# EasyEDA Pro project ProProject_blueberry_2023-11-09.epro, schematic blueberry

## Sheets
1 POWER
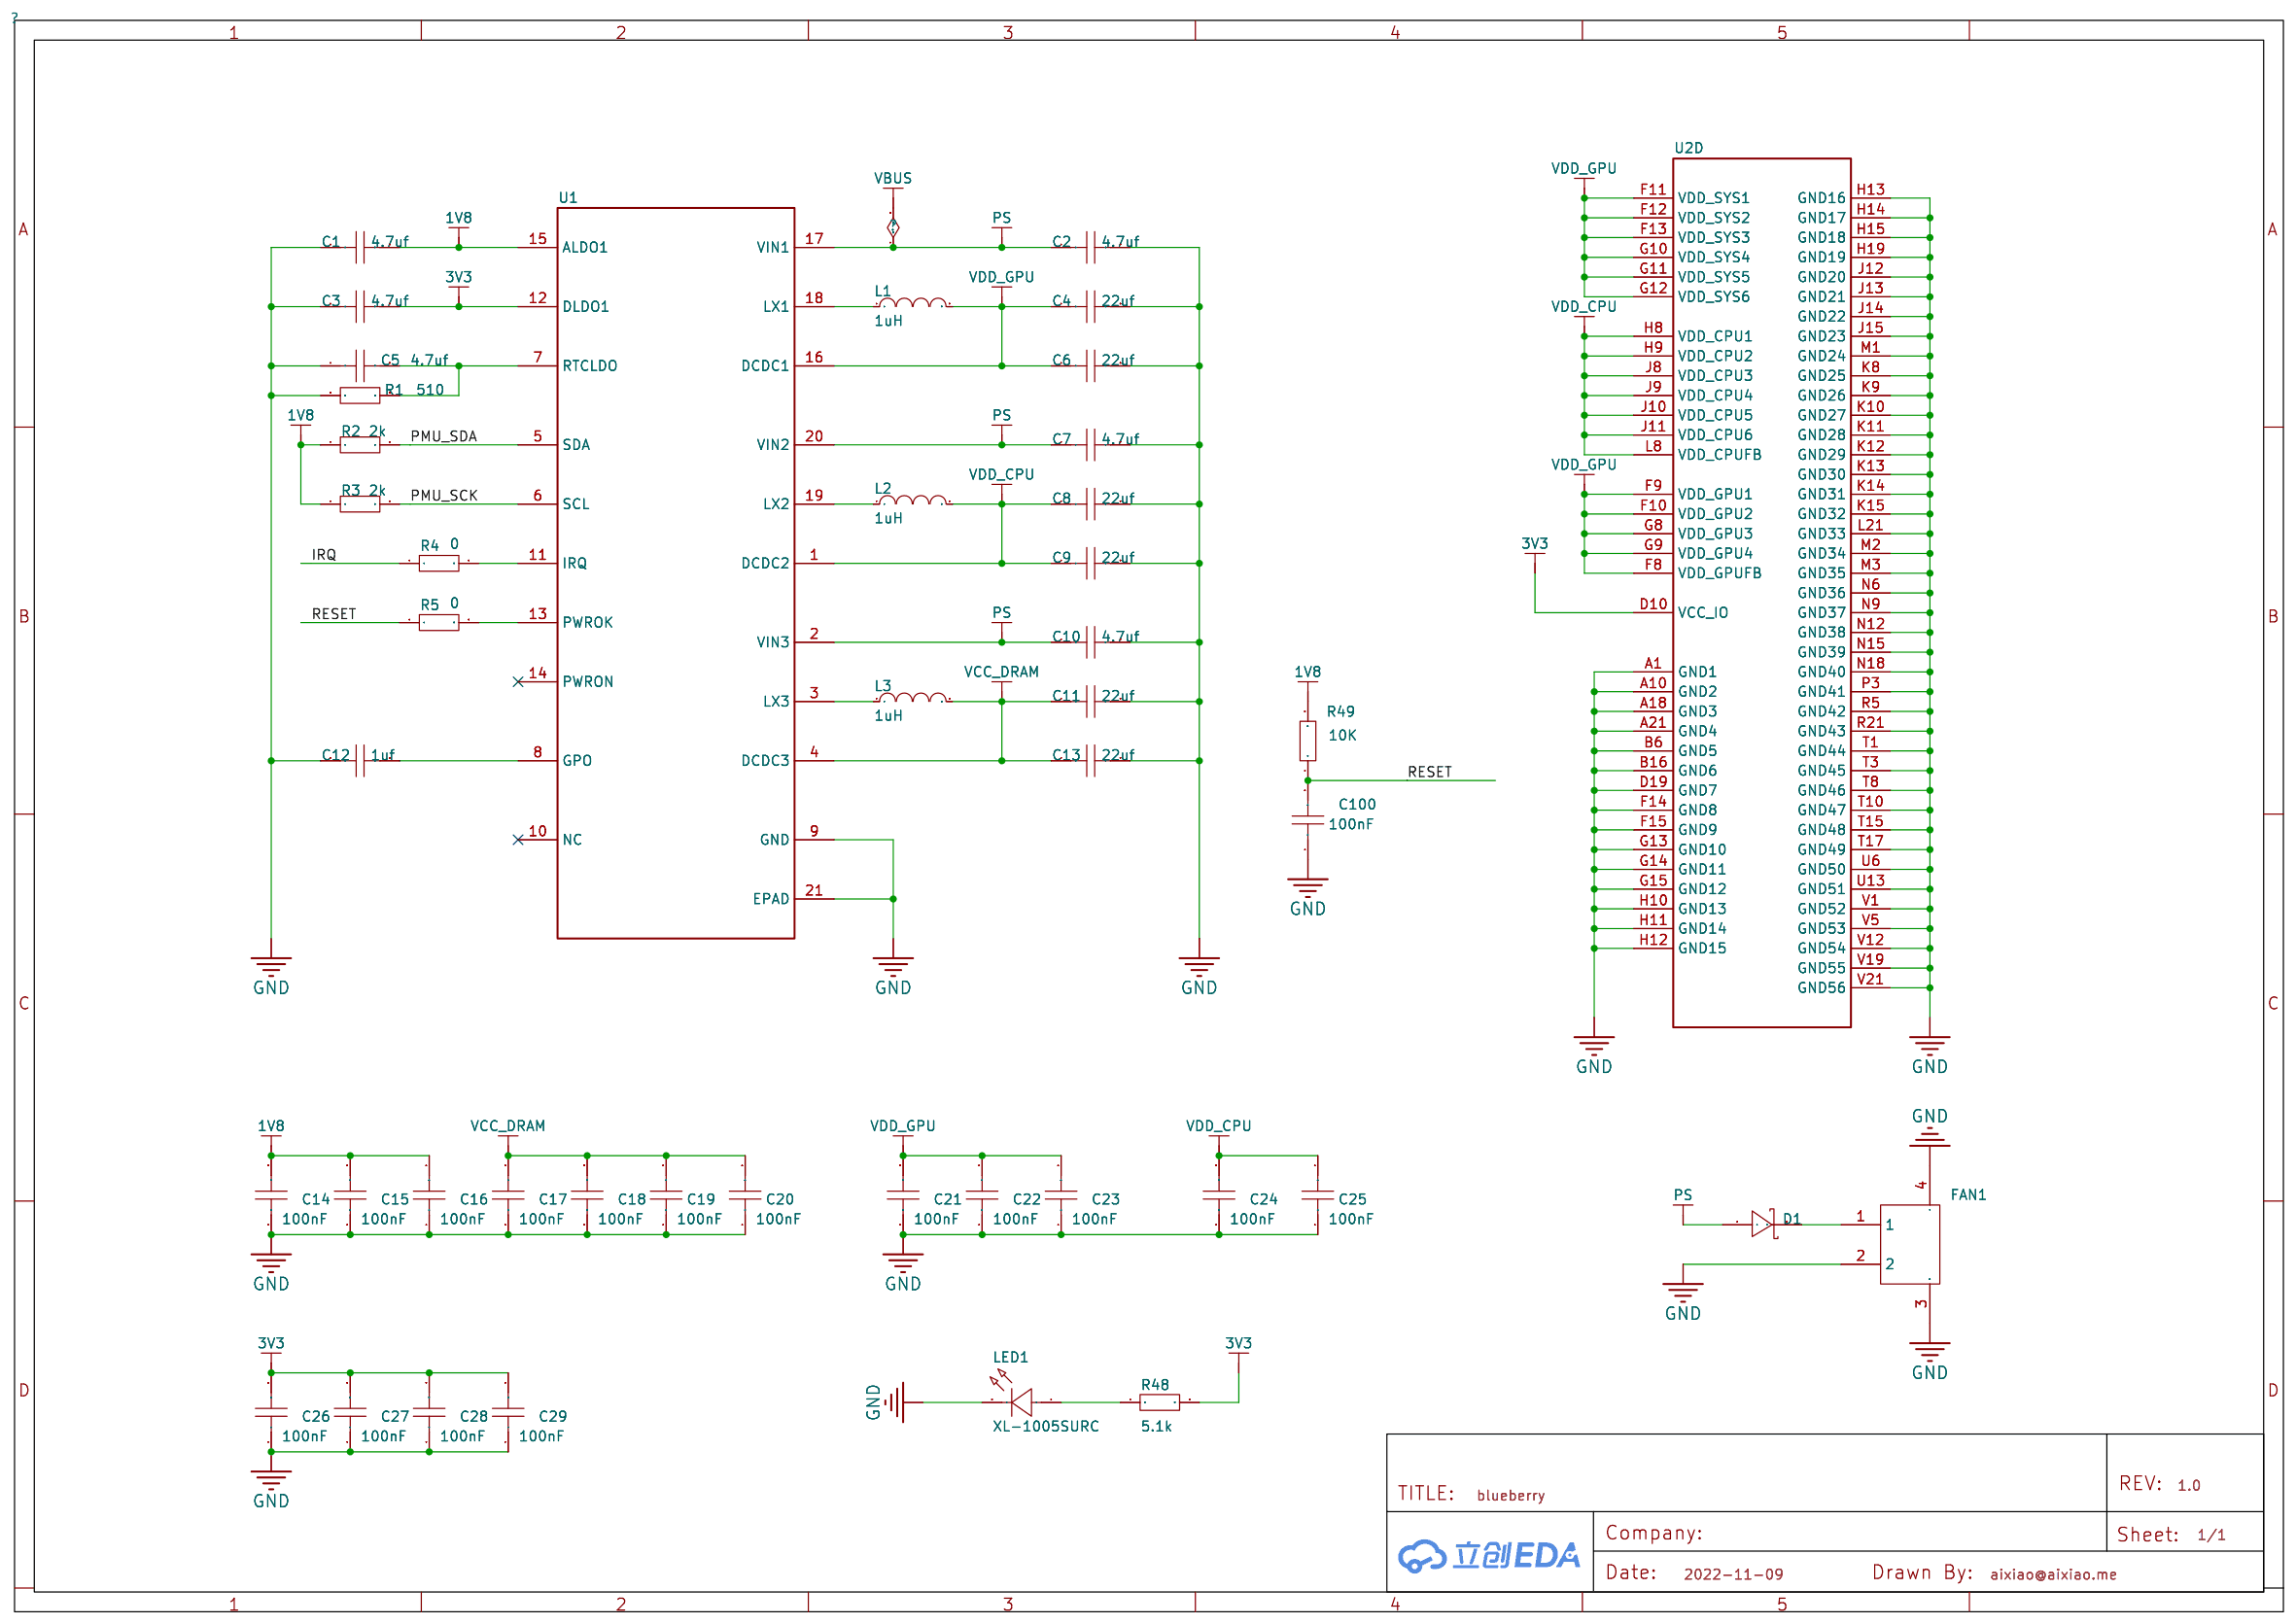
[diagram p0: POWER]
2 DRAM
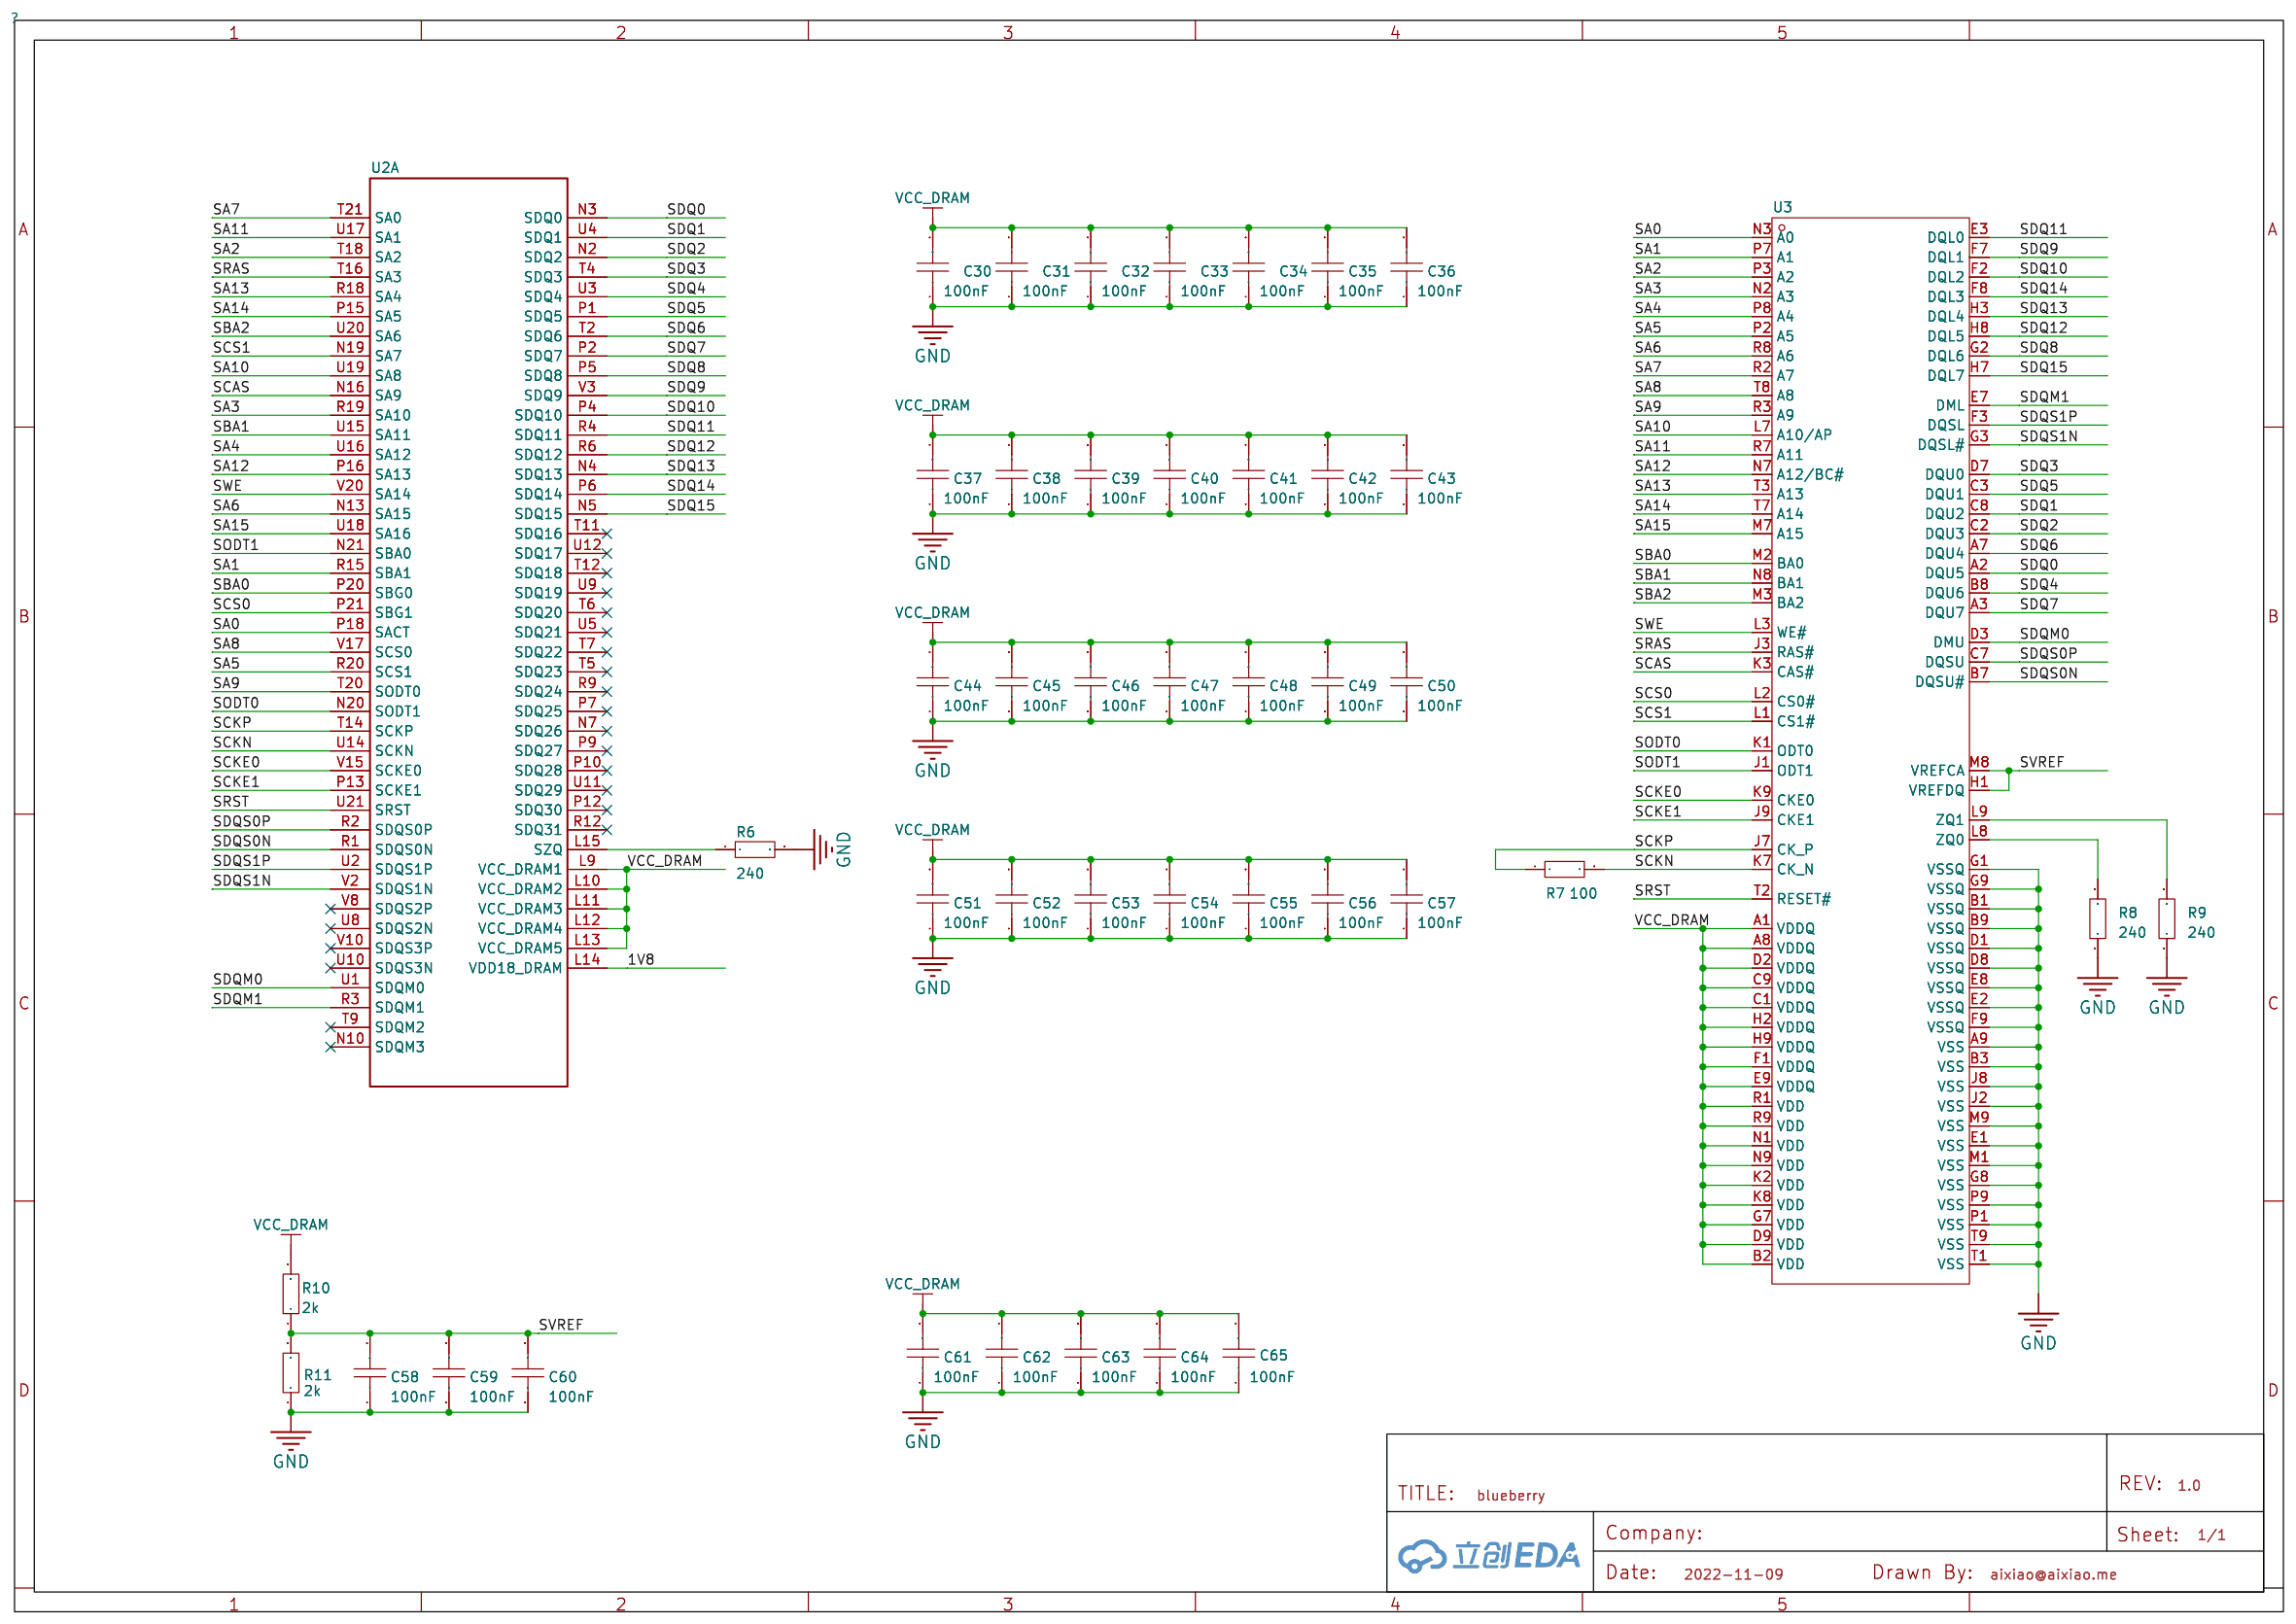
[diagram p1: DRAM]
3 IO
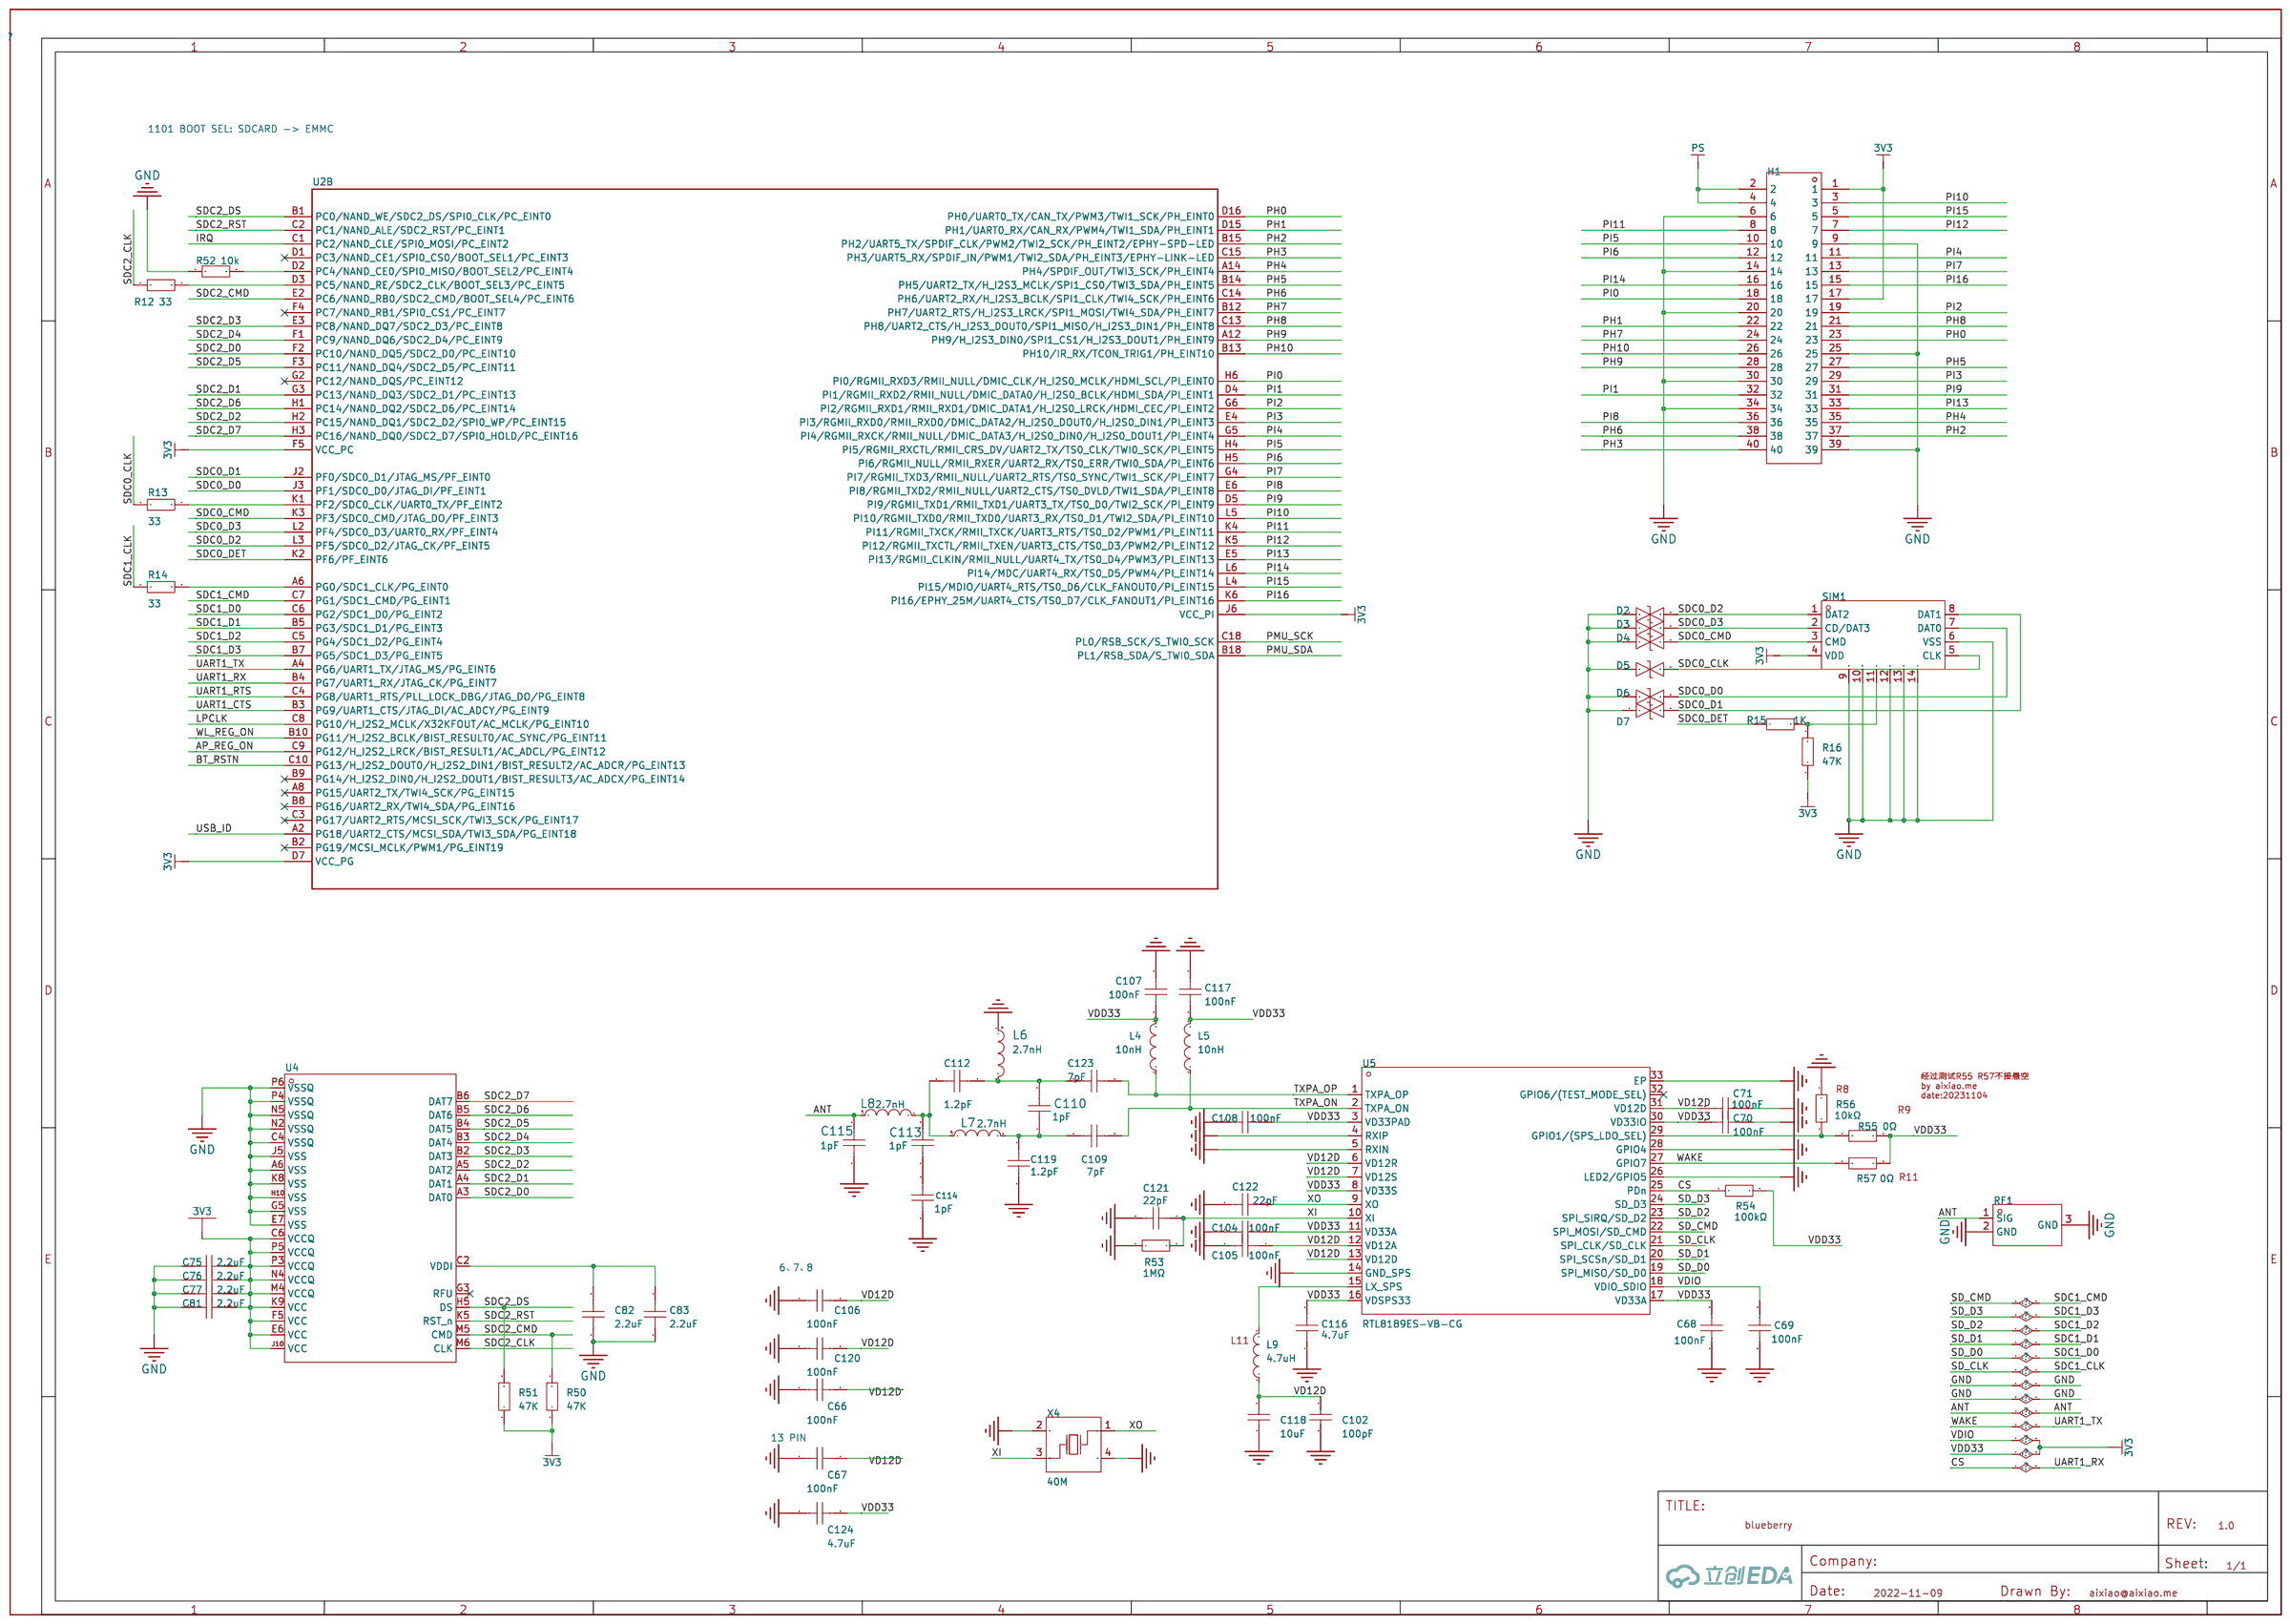
[diagram p2: IO]
4 PLL-IO
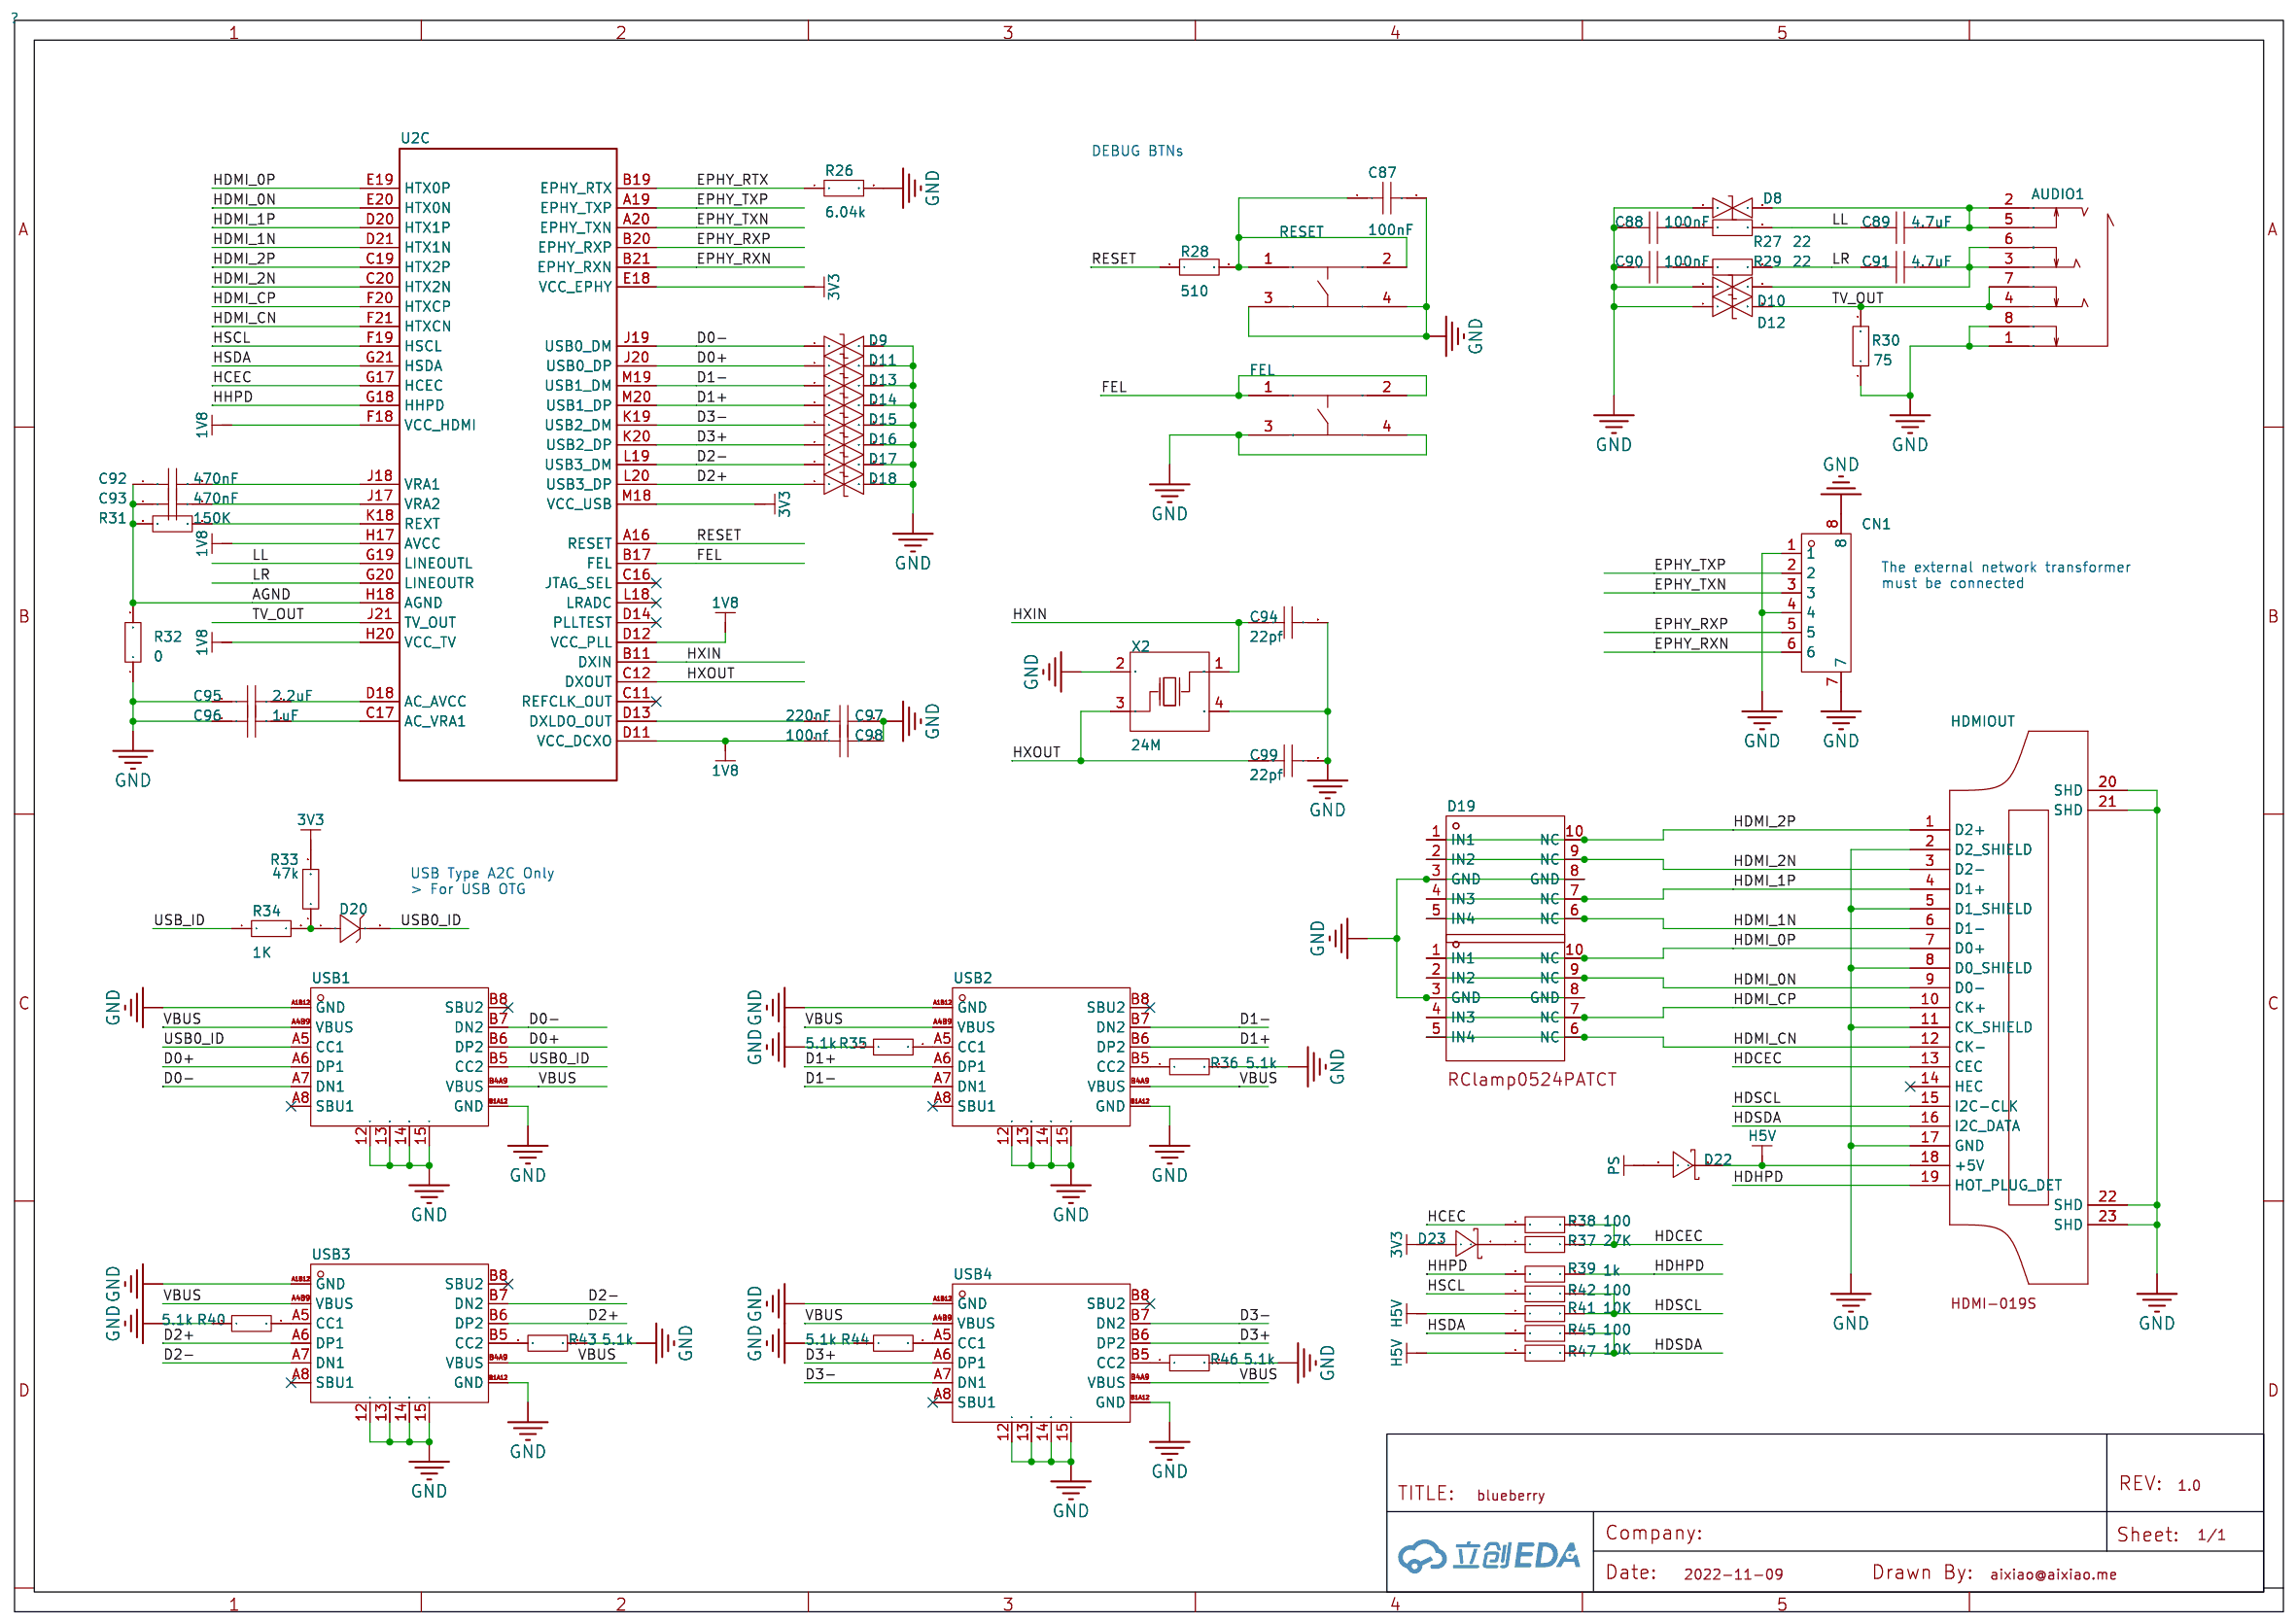
[diagram p3: PLL-IO]

## Parts
sheet DRAM
C30  100nF  [C0402-NSK]
C31  100nF  [C0402-NSK]
C32  100nF  [C0402-NSK]
C33  100nF  [C0402-NSK]
C34  100nF  [C0402-NSK]
C35  100nF  [C0402-NSK]
C36  100nF  [C0402-NSK]
C37  100nF  [C0402-NSK]
C38  100nF  [C0402-NSK]
C39  100nF  [C0402-NSK]
C40  100nF  [C0402-NSK]
C41  100nF  [C0402-NSK]
C42  100nF  [C0402-NSK]
C43  100nF  [C0402-NSK]
C44  100nF  [C0402-NSK]
C45  100nF  [C0402-NSK]
C46  100nF  [C0402-NSK]
C47  100nF  [C0402-NSK]
C48  100nF  [C0402-NSK]
C49  100nF  [C0402-NSK]
C50  100nF  [C0402-NSK]
C51  100nF  [C0402-NSK]
C52  100nF  [C0402-NSK]
C53  100nF  [C0402-NSK]
C54  100nF  [C0402-NSK]
C55  100nF  [C0402-NSK]
C56  100nF  [C0402-NSK]
C57  100nF  [C0402-NSK]
C58  100nF  [C0402-NSK]
C59  100nF  [C0402-NSK]
C60  100nF  [C0402-NSK]
C61  100nF  [C0402-NSK]
C62  100nF  [C0402-NSK]
C63  100nF  [C0402-NSK]
C64  100nF  [C0402-NSK]
C65  100nF  [C0402-NSK]
R6  240  [R0402-NSK_2]
R7  100  [R0402-NSK_2]
R8  240  [R0402-NSK_2]
R9  240  [R0402-NSK_2]
R10  2k  [R0402-NSK_2]
R11  2k  [R0402-NSK_2]
U3  -  [FBGA96]
sheet IO
C66  100nF  [C0201]
C67  100nF  [C0201]
C68  100nF  [C0201]
C69  100nF  [C0201]
C70  100nF  [C0201]
C71  100nF  [C0201]
C75  2.2uF  [C0402-NSK]
C76  2.2uF  [C0402-NSK]
C77  2.2uF  [C0402-NSK]
C81  2.2uF  [C0402-NSK]
C82  2.2uF  [C0402-NSK]
C83  2.2uF  [C0402-NSK]
C102  100pF  [C0201]
C104  100nF  [C0201]
C105  100nF  [C0201]
C106  100nF  [C0201]
C107  100nF  [C0201]
C108  100nF  [C0201]
C109  7pF  [C0201]
C110  1pF  [C0201]
C112  1.2pF  [C0201]
C113  1pF  [C0201]
C114  1pF  [C0201]
C115  1pF  [C0201]
C116  4.7uF  [C0201]
C117  100nF  [C0201]
C118  10uF  [C0402]
C119  1.2pF  [C0201]
C120  100nF  [C0201]
C121  22pF  [C0201]
C122  22pF  [C0201]
C123  7pF  [C0201]
C124  4.7uF  [C0201]
D2  -  [D0402]
D3  -  [D0402]
D4  -  [D0402]
D5  -  [D0402]
D6  -  [D0402]
D7  -  [D0402]
H1  -  [HDR-TH_40P-P2.54-V-M-R2-C20-S2.54]
L4  10nH  [L0201]
L5  10nH  [L0201]
L6  2.7nH  [L0201-RD]
L7  2.7nH  [L0201-RD]
L8  2.7nH  [L0201-RD]
L9  4.7uH  [L0402]
R12  33  [R0402-NSK_2]
R13  33  [R0402-NSK_2]
R14  33  [R0402-NSK_2]
R15  1K  [R0402-NSK_2]
R16  47K  [R0402-NSK_2]
R50  47K  [R0402-NSK_2]
R51  47K  [R0402-NSK_2]
R52  10k  [R0402-NSK_2]
R53  1MΩ  [R0603]
R54  100kΩ  [R0402]
R55  0Ω  [R0402]
R56  10kΩ  [R0402]
R57  0Ω  [R0402]
RF1  BWIPX-1-001E  [IPEX-SMD_BWIPX-1-001E]
SIM1  -  [SIM-SMD_8P-1040310811]
U4  -  [FBGA-153_L13.0-W11.5]
U5  RTL8189ES-VB-CG  [QFN-32_L5.0-W5.0-P0.50-TL-EP3.5]
X4  -  [osc-smd_4p-l2.0-w1.6-bl]
sheet PLL-IO
AUDIO1  -  [AUDIO-TH_PJ-3930-8A]
C87  100nF  [C0402-NSK]
C88  100nF  [C0402-NSK]
C89  4.7uF  [C0402-NSK]
C90  100nF  [C0402-NSK]
C91  4.7uF  [C0402-NSK]
C92  470nF  [C0402-NSK]
C93  470nF  [C0402-NSK]
C94  22pf  [C0402-NSK]
C95  2.2uF  [C0402-NSK]
C96  1uF  [C0402-NSK]
C97  220nF  [C0402-NSK]
C98  100nf  [C0402-NSK]
C99  22pf  [C0402-NSK]
CN1  -  [CONN-SMD_6P-P1.25_53261-0671]
D8  -  [D0402]
D9  -  [D0402]
D10  -  [D0402]
D11  -  [D0402]
D12  -  [D0402]
D13  -  [D0402]
D14  -  [D0402]
D15  -  [D0402]
D16  -  [D0402]
D17  -  [D0402]
D18  -  [D0402]
D19  -  [SLP2510P8_L2.5-W1.0-P0.50-BL]
D20  -  [SOD-523_L1.2-W0.8-LS1.6-FD]
D21  -  [SLP2510P8_L2.5-W1.0-P0.50-BL]
D22  -  [SOD-323_L1.8-W1.3-LS2.5-NSK]
D23  -  [SOD-323_L1.8-W1.3-LS2.5-NSK]
FEL  -  [KEY-SMD_4P-L4.2-W3.2-P2.20-LS4.6_1]
HDMIOUT  -  [HDMI-SMD_HDMI-019S]
R26  6.04k  [R0402-NSK_2]
R27  22  [R0402-NSK_2]
R28  510  [R0402-NSK_2]
R29  22  [R0402-NSK_2]
R30  75  [R0402-NSK_2]
R31  150K  [R0402-NSK_2]
R32  0  [R0402-NSK_2]
R33  47k  [R0402-NSK_2]
R34  1K  [R0402-NSK_2]
R35  5.1k  [R0402-NSK_2]
R36  5.1k  [R0402-NSK_2]
R37  27K  [R0402-NSK_2]
R38  100  [R0402-NSK_2]
R39  1k  [R0402-NSK_2]
R40  5.1k  [R0402-NSK_2]
R41  10K  [R0402-NSK_2]
R42  100  [R0402-NSK_2]
R43  5.1k  [R0402-NSK_2]
R44  5.1k  [R0402-NSK_2]
R45  100  [R0402-NSK_2]
R46  5.1k  [R0402-NSK_2]
R47  10K  [R0402-NSK_2]
RESET  -  [KEY-SMD_4P-L4.2-W3.2-P2.20-LS4.6_1]
USB1  -  [USB-C-SMD_TYPEC-304-BCP16-1]
USB2  -  [USB-C-SMD_TYPEC-304-BCP16-1]
USB3  -  [USB-C-SMD_TYPEC-304-BCP16-1]
USB4  -  [USB-C-SMD_TYPEC-304-BCP16-1]
X2  -  [OSC-SMD_4P-L2.0-W1.6-BL]
sheet POWER
C1  4.7uf  [C0402-NSK]
C2  4.7uf  [C0603 NSK]
C3  4.7uf  [C0402-NSK]
C4  22uf  [C0603 NSK]
C5  4.7uf  [C0402-NSK]
C6  22uf  [C0603 NSK]
C7  4.7uf  [C0603 NSK]
C8  22uf  [C0603 NSK]
C9  22uf  [C0603 NSK]
C10  4.7uf  [C0603 NSK]
C11  22uf  [C0603 NSK]
C12  1uf  [C0402-NSK]
C13  22uf  [C0603 NSK]
C14  100nF  [C0402-NSK]
C15  100nF  [C0402-NSK]
C16  100nF  [C0402-NSK]
C17  100nF  [C0402-NSK]
C18  100nF  [C0402-NSK]
C19  100nF  [C0402-NSK]
C20  100nF  [C0402-NSK]
C21  100nF  [C0402-NSK]
C22  100nF  [C0402-NSK]
C23  100nF  [C0402-NSK]
C24  100nF  [C0402-NSK]
C25  100nF  [C0402-NSK]
C26  100nF  [C0402-NSK]
C27  100nF  [C0402-NSK]
C28  100nF  [C0402-NSK]
C29  100nF  [C0402-NSK]
C100  100nF  [C0402-NSK]
D1  -  [SOD-323_L1.8-W1.3-LS2.5-NSK]
FAN1  -  [CONN-SMD_2P-P1.25_053398-0X71]
L1  1uH  [IND-SMD_L2.0-W1.6_1]
L2  1uH  [IND-SMD_L2.0-W1.6_1]
L3  1uH  [IND-SMD_L2.0-W1.6_1]
LED1  XL-1005SURC  [LED0402-R-RD_RED]
R1  510  [R0402-NSK_2]
R2  2k  [R0402-NSK_2]
R3  2k  [R0402-NSK_2]
R4  0  [R0402-NSK_2]
R5  0  [R0402-NSK_2]
R48  5.1k  [R0402-NSK_2]
R49  10K  [R0402-NSK_2]
U1  AXP313A  [WQFN-20_L3.0-W3.0-P0.40-BL-EP]
U2  -  [BGA284P65B1200_1400H125]  (sections DRAM,IO,PLL-IO,POWER)

## Library data of the parts
C1 C3 C5 C12 C14-C65 C75-C77 C81-C83 C88-C100 = CAP_0402: 容值:100nF;精度:±10%;额定电压:16V;温度系数:X7R;; Supplier Part: C1525; Supplier Footprint: 0402
R1-R16 R26 R27 R29-R52 = Res_0402: Supplier Footprint: 0402
U3 = H5TQ4G63EFR-RDC: Pin Type: IN; Supplier: LCSC; Supplier Part: C2803259; Manufacturer: HYNIX(海力士); JLCPCB Part Class: Extended Part
C66-C71 C104-C108 C117 C120 = CL03A104KO3NNNC: 容值:100nF;精度:±10%;额定电压:16V;材质(温度系数):X5R;; LCSC Part Name: 100nF ±10% 16V; Supplier Part: C307380; Manufacturer: SAMSUNG(三星); Supplier Footprint: 0201; JLCPCB Part Class: Extended Part; Datasheet: https://atta.szlcsc.com/upload/public/pdf/source/20181009/C307380_E0679AAF9658ADA26DBF30CED0CA6925.pdf; Supplier: LCSC; Tolerance: ±10%; Voltage Rated: 16V; Temperature Coefficient: X5R
C102 = 0201CG101J500NT: 容值:100pF;精度:±5%;额定电压:50V;材质(温度系数):C0G;; LCSC Part Name: 100pF ±5% 50V; Supplier Part: C62550; Manufacturer: FH(风华); Supplier Footprint: 0201; JLCPCB Part Class: Extended Part; Datasheet: https://atta.szlcsc.com/upload/public/pdf/source/20170923/C62550_1506149508441988872.pdf; Supplier: LCSC; Tolerance: ±5%; Voltage Rated: 50V; Temperature Coefficient: C0G
C109 C123 = 0201CG7R0C250NT: 容值:7pF;额定电压:25V;材质(温度系数):C0G;; LCSC Part Name: 7pF 25V ±0.25pF; Supplier Part: C285008; Manufacturer: FH(风华); Supplier Footprint: 0201; JLCPCB Part Class: Extended Part; Datasheet: https://atta.szlcsc.com/upload/public/pdf/source/20180913/C285008_DDE36D4273103A8680C76AA349266812.pdf; Supplier: LCSC; Voltage Rated: 25V; Temperature Coefficient: C0G
C110 C113-C115 = GRM0335C1H1R0WA01D: 容值:1pF;额定电压:50V;材质(温度系数):C0G;; LCSC Part Name: 1pF 50V ±0.05pF; Supplier Part: C161411; Manufacturer: muRata(村田); Supplier Footprint: 0201; JLCPCB Part Class: 扩展库; Supplier: LCSC; Voltage Rated: 50V; Temperature Coefficient: C0G
C112 C119 = 0201CG1R2B500NT: 容值:1.2pF;额定电压:50V;材质(温度系数):C0G;; LCSC Part Name: 1.2pF 50V ±0.1pF; Supplier Part: C285029; Manufacturer: FH(风华); Supplier Footprint: 0201; JLCPCB Part Class: 扩展库; Datasheet: https://atta.szlcsc.com/upload/public/pdf/source/20181114/C285029_0C5D119607974C175CB3AD86C75729DF.pdf; Supplier: LCSC; Voltage Rated: 50V; Temperature Coefficient: C0G
C116 C124 = GRM035R60J475ME15D: 容值:4.7uF;精度:±20%;额定电压:6.3V;材质(温度系数):X5R;; LCSC Part Name: 4.7uF ±20% 6.3V; Supplier Part: C335103; Manufacturer: muRata(村田); Supplier Footprint: 0201; JLCPCB Part Class: Extended Part; Datasheet: https://atta.szlcsc.com/upload/public/pdf/source/20181123/C335103_65BC12EC0C1BBB7D605A3646AEC2CDDD.pdf; Supplier: LCSC; Tolerance: ±20%; Voltage Rated: 6.3V; Temperature Coefficient: X5R
C118 = CL05A106MQ5NUNC: 容值:10uF;精度:±20%;额定电压:6.3V;材质(温度系数):X5R;; LCSC Part Name: 10uF ±20% 6.3V; Supplier Part: C15525; Manufacturer: SAMSUNG(三星); Supplier Footprint: 0402; JLCPCB Part Class: 基础库; Datasheet: https://atta.szlcsc.com/upload/public/pdf/source/20220823/2B02EE04F8F211D38A52DCB16EB6BEBA.pdf; Supplier: LCSC; Tolerance: ±20%; Voltage Rated: 6.3V; Temperature Coefficient: X5R
C121 C122 = CC0201JRNPO9BN220: 容值:22pF;精度:±5%;额定电压:50V;材质(温度系数):NP0;; LCSC Part Name: 22pF ±5% 50V; Supplier Part: C272881; Manufacturer: YAGEO(国巨); Supplier Footprint: 0201; JLCPCB Part Class: Extended Part; Datasheet: https://atta.szlcsc.com/upload/public/pdf/source/20180820/C272881_2D3730AA9A71748A0E9B09862C637263.pdf; Supplier: LCSC; Tolerance: ±5%; Voltage Rated: 50V; Temperature Coefficient: NP0
D2-D18 = 0402ESDA-05N: 极性:Bidirectional;反向关断电压（典型值）:5V;击穿电压（最小值）:-;箝位电压:50V;峰值脉冲电流（10/1000us）:-;; Supplier Part: C316049; Manufacturer: BORN伯恩半导体; Supplier Footprint: 0402; JLCPCB Part Class: Extended Part; Datasheet: https://atta.szlcsc.com/upload/public/pdf/source/20181026/C316049_37ABAC87650F175221BFB473159300DE.pdf; Supplier: LCSC; Polarity: Bidirectional; Voltage - Reverse Standoff (Typ): 5V; Voltage - Clamping (Max) @ Ipp: 50V
H1 = B-2100S40P-B110: 间距:2.54mm;总PIN位数:40;排数:2;插针结构:2x20P;行距:2.54mm;安装类型:直插;圆针/方针:-;额定电流:-;额定电压:-;配合针长度:6mm;塑高:2.54mm;端接针长度:3mm;触头材质:黄铜;触头镀层:-;工作温度范围:-40~+105;颜色:黑色;; LCSC Part Name: 2.54mm 2x20P; Supplier Part: F; Manufacturer: Ckmtw(灿科盟); Supplier Footprint: 插件,P=2.54mm; JLCPCB Part Class: Extended Part; Datasheet: https://atta.szlcsc.com/upload/public/pdf/source/20170821/C124383_1503303310291901537.pdf; Supplier: LCSC; Pitch: 2.54mm; Number of Pins: 40; Number of Rows: 2; Pin Structure: 2x20P; Row Spacing: 2.54mm; Mounting Type: 直插; Length of Mating Pin: 6mm; Insulation Height: 2.54mm; Length of End Connection Pin: 3mm; Contact Material: 黄铜; Operating Temperature Range: -40~+105; Color: 黑色
L4 L5 = LQP03TN10NH02D: 电感值:10nH;精度:±3%;额定电流:250mA;饱和电流(Isat):-;直流电阻(DCR):700mΩ;; LCSC Part Name: 10nH ±3%; Supplier Part: C162594; Manufacturer: muRata(村田); Supplier Footprint: 0201; JLCPCB Part Class: 扩展库; Datasheet: https://atta.szlcsc.com/upload/public/pdf/source/20181119/C162594_88279D127F1D48BC7257D97B9E7550BC.pdf; Supplier: LCSC; Tolerance: ±3%; Rated Current: 250mA; DC Resistance (DCR): 700mΩ; Q @ Freq: 14@500MHz; Frequency - Self Resonant: 3.2GHz
L6-L8 = SDCL0603Q2N7BT02B03: 电感值:2.7nH;额定电流:500mA;饱和电流(Isat):-;直流电阻(DCR):200mΩ;; LCSC Part Name: 2.7nH ±0.1nH; Supplier Part: C279775; Manufacturer: Sunlord(顺络); Supplier Footprint: 0201; JLCPCB Part Class: 扩展库; Datasheet: https://atta.szlcsc.com/upload/public/pdf/source/20210916/39E5BFACACA0ED60A4EB572A4BDC5C8A.pdf; Supplier: LCSC; Rated Current: 500mA; DC Resistance (DCR): 200mΩ; Q @ Freq: 13@500MHz; Frequency - Self Resonant: 500MHz
L9 = MLZ1005N4R7LTD25: 电感值:4.7uH;精度:±20%;额定电流:-;饱和电流(Isat):-;直流电阻(DCR):-;; LCSC Part Name: 4.7uH ±20%; Supplier Part: C404795; Manufacturer: TDK; Supplier Footprint: 0402; JLCPCB Part Class: 扩展库; Datasheet: https://atta.szlcsc.com/upload/public/pdf/source/20190722/C404795_AC5F02D6580F63BF636960C003744397.pdf; Supplier: LCSC; Tolerance: ±20%
R53 = 0603WAF1004T5E: 电阻类型:厚膜电阻;阻值:1MΩ;精度:±1%;功率:100mW;; LCSC Part Name: 1MΩ ±1% 100mW; Supplier Part: C22935; Manufacturer: UNI-ROYAL(厚声); Supplier Footprint: 0603; JLCPCB Part Class: Basic Part; Datasheet: https://atta.szlcsc.com/upload/public/pdf/source/20200306/C422600_1E6D84923E4A46A82E41ADD87F860B5C.pdf; Supplier: LCSC; Type: 厚膜电阻; Tolerance: ±1%; Power(Watts): 100mW; Temperature Coefficient: ±100ppm/℃; Overload Voltage (Max): 75V; Operating Temperature Range: -55℃~+155℃
R54 = RC0402FR-07100KL: 电阻类型:厚膜电阻;阻值:100kΩ;精度:±1%;功率:62.5mW;; LCSC Part Name: 100kΩ ±1% 62.5mW; Supplier Part: C60491; Manufacturer: YAGEO(国巨); Supplier Footprint: 0402; JLCPCB Part Class: Extended Part; Datasheet: https://atta.szlcsc.com/upload/public/pdf/source/20170518/1495086055123.pdf; Supplier: LCSC; Type: 厚膜电阻; Tolerance: ±1%; Power(Watts): 62.5mW; Temperature Coefficient: ±100ppm/℃; Overload Voltage (Max): 50V; Operating Temperature Range: -55℃~+155℃
R55 R57 = 0402WGF0000TCE: 电阻类型:厚膜电阻;阻值:0Ω;精度:±1%;功率:62.5mW;; LCSC Part Name: 0Ω ±1% 62.5mW; Supplier Part: C17168; Manufacturer: UNI-ROYAL(厚声); Supplier Footprint: 0402; JLCPCB Part Class: 基础库; Datasheet: https://atta.szlcsc.com/upload/public/pdf/source/20200306/C422600_1E6D84923E4A46A82E41ADD87F860B5C.pdf; Supplier: LCSC; Type: 厚膜电阻; Tolerance: ±1%; Power(Watts): 62.5mW; Temperature Coefficient: ±800ppm/℃; Overload Voltage (Max): 50V; Operating Temperature Range: -55℃~+155℃
R56 = RC0402FR-0710KL: 电阻类型:厚膜电阻;阻值:10kΩ;精度:±1%;功率:62.5mW;; LCSC Part Name: 10kΩ ±1% 62.5mW; Supplier Part: C60490; Manufacturer: YAGEO(国巨); Supplier Footprint: 0402; JLCPCB Part Class: Extended Part; Datasheet: https://atta.szlcsc.com/upload/public/pdf/source/20170606/1496716515432.pdf; Supplier: LCSC; Type: 厚膜电阻; Tolerance: ±1%; Power(Watts): 62.5mW; Temperature Coefficient: ±100ppm/℃; Overload Voltage (Max): 50V; Operating Temperature Range: -55℃~+155℃
RF1 = BWIPX-1-001E: 连接器类型:板端;射频系列:IPEX;接口类型:内针;端口数量:1;阻抗:50Ω;频率-最大值:6GHz;样式:-;接口直径:-;接口长度/高度:-;工作温度范围:-;; LCSC Part Name: IPEX内针IPEX内针天线座IPEX-1IPEX11代; Supplier Part: C496552; Manufacturer: BATWIRELESS(蝙蝠无线); Supplier Footprint: SMD; JLCPCB Part Class: ExtendedPart; Datasheet: https://atta.szlcsc.com/upload/public/pdf/source/20201223/C496552_05E5A9956EAE1A8819C5051D085B1DED.pdf; Supplier: LCSC; Connector Type: 板端; RF Series: IPEX; Interface Type: 内针; Number of Ports: 1; Impedance: 50Ω; Frequency-Max: 6GHz
SIM1 = 1040310811: 卡连接方式:拔插式;卡类型:MicroSD卡(TF卡);连接器类型:卡座;本体最大高度:1.42mm;工作温度范围:-;; LCSC Part Name: 拔插式 MicroSD卡(TF卡) 卡座; Supplier Part: C585350; Manufacturer: MOLEX; Supplier Footprint: SMD; JLCPCB Part Class: Extended Part; Datasheet: https://atta.szlcsc.com/upload/public/pdf/source/20201117/C585350_D1F0B30BD23514449186B2E50ACE8BBF.pdf; Supplier: LCSC; Card Connection Mode: 拔插式; Card Type: MicroSD卡(TF卡); Connector Type: 卡座; Maximum Body Height: 1.42mm
U4 = EMMC BGA153: Pin Type: IN; Supplier: LCSC; Supplier Part: C577446; Manufacturer: Kingston(金士顿); Manufacturer Part: EMMC04G-M627-A01
U5 = RTL8189ES-VB-CG: Supplier Part: C2691978; Manufacturer: REALTEK(瑞昱); Supplier Footprint: QFN-32-EP(5x5); JLCPCB Part Class: 扩展库; Datasheet: https://atta.szlcsc.com/upload/public/pdf/source/20210224/C2691978_AD3BA0D50963F7E0CEF6C753B8065BC6.pdf; Supplier: LCSC
X2 X4 = SX32Y024000BC1T: 晶振类型:-;频率:-;频率公差:-;频率稳定度:-;负载电容:-;工作温度:-;; LCSC Part Name: 3225 24M 12PF  10ppm  -20 -75; Supplier Part: C271629; Manufacturer: TKD(泰晶); Supplier Footprint: SMD3225-4P; JLCPCB Part Class: Extended Part; Datasheet: https://atta.szlcsc.com/upload/public/pdf/source/20180829/C271629_CA81D930E8823EB83EE4F79A596DDEFE.pdf; Supplier: LCSC
AUDIO1 = PJ-3930-8A: 连接器类型:3.5mm耳机座;额定电流:500mA;额定电压:30V;; LCSC Part Name: 3.5mm耳机座; Supplier Part: C145811; Manufacturer: 韩国韩荣; Supplier Footprint: 插件; JLCPCB Part Class: Extended Part; Datasheet: https://atta.szlcsc.com/upload/public/pdf/source/20191118/C145811_16CC6EB1D99F73F69A2815454A66484C.pdf; Supplier: LCSC; Connector Type: 3.5mm耳机座; Current Rating (Max): 500mA; Voltage Rating (Max): 30V
C87 = FN15X104K250PNG: 容值:100nF;精度:±10%;额定电压:25V;温度系数:X7R;; LCSC Part Name: 100nF ±10% 25V; Supplier Part: C525225; Manufacturer: PSA(信昌电陶); Supplier Footprint: 0402; JLCPCB Part Class: Extended Part; Datasheet: https://atta.szlcsc.com/upload/public/pdf/source/20200506/C436246_4EAA78C9048D88437BAF2CB7B8BE45FD.pdf; Supplier: LCSC; Tolerance: ±10%; Voltage Rated: 25V; Temperature Coefficient: X7R
CN1 = 532610671: 参考系列:-;间距:1.25mm;插针结构:1x6P;排数:1;每排PIN数:6;行距:-;安装方式:-;触头材质:青铜;; Supplier Part: C99277; Manufacturer: MOLEX; JLCPCB Part Class: Extended Part; Datasheet: https://atta.szlcsc.com/upload/public/pdf/source/20180713/C99277_7A4A98FEF11A2209B5FFC17F14BF7E54.pdf; Supplier: LCSC; Pitch: 1.25mm; Pins Structure: 1x6P; Number of Rows: 1; Number of PINs Per Row: 6; Contact Material: 青铜
D19 D21 = RClamp0524PATCT: VBR=6V， Vc=15V ，Ipp=5A; Supplier Part: C40960; Manufacturer: SEMTECH; Supplier Footprint: SLP2510P8; JLCPCB Part Class: Extended Part; Datasheet: https://atta.szlcsc.com/upload/public/pdf/source/20150124/1457707260739.pdf; Supplier: LCSC
D20 = 1N5819-SOD523: Supplier Part: C9900001291; Supplier Footprint: SOD-523_L1.2-W0.8-LS1.60; JLCPCB Part Class: Extended Part; Supplier: LCSC
D1 D22 D23 = B5819WS: 直流反向耐压(Vr):40V;平均整流电流(Io):1A;正向压降(Vf):600mV@1A;; LCSC Part Name: 40V 1A 600mV@1A; Supplier Part: C22624; Manufacturer: CJ（江苏长电/长晶）; Supplier Footprint: SOD-323; JLCPCB Part Class: Extended Part; Datasheet: https://atta.szlcsc.com/upload/public/pdf/source/20170919/C22624_1505799673448977596.pdf; Supplier: LCSC; Reverse Voltage (Vr): 40V; Average Rectified Current (Io): 1A; Forward Voltage (Vf@If): 600mV@1A
FEL RESET = PTS810SJM250SMTRLFS: 触点电流:50mA;额定电压(DC):16V;电路结构:单刀单掷;安装方式:立贴;按钮形状:圆形按钮;带灯:-;开关长度:4.2mm;开关宽度:3.2mm;开关高度:2.5mm;; Supplier Part: C116501; Manufacturer: CK; Supplier Footprint: SMD; JLCPCB Part Class: Extended Part; Datasheet: https://atta.szlcsc.com/upload/public/pdf/source/20180704/C116501_199B7AD0EF93D1F69D47FA53D559C299.pdf; Supplier: LCSC; Contact Current: 50mA; Voltage Rating (DC): 16V; Circuit: 单刀单掷; Mounting Style: 立贴; Actuator Style: 圆形按钮; Switch Length: 4.2mm; Switch Width: 3.2mm; Switch Height: 2.5mm
HDMIOUT = HDMI-019S: 连接器类型:HDMI;公母:母;总PIN位数:19;排数:-;安装方式:卧贴;额定电流:500mA;工作温度范围:-25~+75;; LCSC Part Name: HDMI 母 P数:19; Supplier Part: C111617; Manufacturer: SOFNG(硕方); Supplier Footprint: SMD; JLCPCB Part Class: Extended Part; Datasheet: https://atta.szlcsc.com/upload/public/pdf/source/20200911/C111617_84DD1BD35B9EB8A28224A63520745D0A.pdf; Supplier: LCSC; Connector Type: HDMI; Gender: 母; Number of Pins: 19; Mounting Style: 卧贴; Current Rating (Max): 500mA; Operating Temperature Range: -25~+75
R28 = TR0402D10K0Q1025Z: 电阻类型:薄膜电阻;阻值:10kΩ;精度:±0.5%;功率:63mW;温度系数:±25ppm/;最大工作电压:25V;工作温度范围:-55~+155;; LCSC Part Name: 10kΩ ±0.5%; Supplier Part: C149898; Manufacturer: EVER OHMS(天二科技); Supplier Footprint: 0402; JLCPCB Part Class: Extended Part; Datasheet: https://atta.szlcsc.com/upload/public/pdf/source/20190415/C149898_7B08651CD36798FFD08F99A8D38CFCAF.pdf; Supplier: LCSC; Type: 薄膜电阻; Tolerance: ±0.5%; Power(Watts): 63mW; Temperature Coefficient: ±25ppm/; Overload Voltage (Max): 25V; Operating Temperature Range: -55~+155
USB1-USB4 = TYPEC-304-BCP16: Pin Type: IN; Supplier: LCSC; Supplier Part: C720629; Manufacturer: XUNPU; JLCPCB Part Class: Extended Part
C2 C4 C6-C11 C13 = CAP_0603: 容值:100nF;精度:±10%;额定电压:50V;温度系数:X7R;; Supplier Footprint: 0603
FAN1 = 0533980271: 参考系列:-;间距:1.25mm;插针结构:1x2P;排数:1;每排PIN数:2;行距:-;公母:公型插针;安装方式:立贴;额定电流:-;工作温度范围:-;; LCSC Part Name: 线至板连接器,2触点,针座,1.25mm,贴装,1排; Supplier Part: C122410; Manufacturer: MOLEX; Supplier Footprint: SMD,P=1.25mm; JLCPCB Part Class: Extended Part; Datasheet: https://atta.szlcsc.com/upload/public/pdf/source/20170721/C122410_1500619309943834053.pdf; Supplier: LCSC; Pitch: 1.25mm; Pins Structure: 1x2P; Number of Rows: 1; Number of PINs Per Row: 2; Gender: 公型插针; Mounting Style: 立贴
L1-L3 = CKCS201610-2.2uH/M_2: 电感值:2.2uH;精度:±20%;额定电流:1.1A;直流电阻(DCR):264mΩ;; LCSC Part Name: 2.2uH ±20% 1.1A 264mΩ; Supplier Part: C354533; Manufacturer: CENKER(岑科); Manufacturer Part: CKCS201610-2.2uH/M; LCSC On Sale: 1; Supplier Footprint: SMD; JLCPCB Part Class: Extended Part; JLCPCB On Sale: 1; Datasheet: https://atta.szlcsc.com/upload/public/pdf/source/20190315/C354533_59121B22FE01331804674A67C9C7C2C4.pdf; Supplier: LCSC; Tolerance: ±20%; Rated Current: 1.1A; DC Resistance (DCR): 264mΩ
LED1 = XL-1005SURC: 发光颜色:红灯;主波长:620nm;色温:6000K~7000K;功率:55mW;安装方式:正贴;; LCSC Part Name: 红灯 正贴 色温6000K~7000K; Supplier Part: C965790; Manufacturer: XINGLIGHT(成兴光); Supplier Footprint: 0402; JLCPCB Part Class: Extended Part; Datasheet: https://atta.szlcsc.com/upload/public/pdf/source/20221102/EBA3AB29C2D5B62EE70B36967F8F8809.pdf; Supplier: LCSC; Emitted Color: 红灯; Lens Color: 无色透明; Dominant Wavelength: 620nm; Peak Wavelength: 625nm; Color Temperature: 6000K~7000K; Forward Current: 25mA; Power Dissipation: 55mW; Viewing Angle: 120°; Mounting Sytle: 正贴; Operating Temperature: -30℃~+85℃
U1 = AXP1530: PCB Footprint: QFN21P40B300_300H78; Origin Footprint 2: QFN21P40B300_300H78
U2 = Allwinner_H616

## Nets
1V8: C1.2 C14.2 C15.2 C16.2 C98.1 R2.1 R3.1 R49.2 U1.15(ALDO1) U2.D11(VCC_DCXO) U2.D12(VCC_PLL) U2.F18(VCC_HDMI) U2.H17(AVCC) U2.H20(VCC_TV) U2.L14(VDD18_DRAM)
3V3: C3.2 C26.2 C27.2 C28.2 C29.2 C68.2 C69.2 C70.2 C75.2 C76.2 C77.2 C81.2 C104.1 C107.2 C108.1 C116.2 C117.2 C124.1 D23.2(A) H1.1 H1.17 L4.2 L5.2 R16.1 R33.2 R48.2 R50.1 R51.1 R54.2 R55.1 R57.1 SIM1.4(VDD) U1.12(DLDO1) U2.D7(VCC_PG) U2.D10(VCC_IO) U2.E18(VCC_EPHY) U2.F5(VCC_PC) U2.J6(VCC_PI) U2.M18(VCC_USB) U4.C6(VCCQ) U4.E6(VCC) U4.F5(VCC) U4.J10(VCC) U4.K9(VCC) U4.M4(VCCQ) U4.N4(VCCQ) U4.P3(VCCQ) U4.P5(VCCQ) U5.3(VD33PAD) U5.8(VD33S) U5.11(VD33A) U5.16(VDSPS33) U5.17(VD33A) U5.18(VDIO_SDIO) U5.30(VD33IO)
AGND: C92.1 C93.1 R31.1 R32.2 U2.H18(AGND)
GND: AUDIO1.1 AUDIO1.8 C1.1 C2.2 C3.1 C4.2 C5.1 C6.2 C7.2 C8.2 C9.2 C10.2 C11.2 C12.1 C13.2 C14.1 C15.1 C16.1 C17.1 C18.1 C19.1 C20.1 C21.1 C22.1 C23.1 C24.1 C25.1 C26.1 C27.1 C28.1 C29.1 C30.1 C31.1 C32.1 C33.1 C34.1 C35.1 C36.1 C37.1 C38.1 C39.1 C40.1 C41.1 C42.1 C43.1 C44.1 C45.1 C46.1 C47.1 C48.1 C49.1 C50.1 C51.1 C52.1 C53.1 C54.1 C55.1 C56.1 C57.1 C58.1 C59.1 C60.1 C61.1 C62.1 C63.1 C64.1 C65.1 C66.2 C67.2 C68.1 C69.1 C70.1 C71.1 C75.1 C76.1 C77.1 C81.1 C82.1 C83.1 C87.2 C88.1 C90.1 C94.2 C95.1 C96.1 C97.2 C98.2 C99.2 C100.1 C102.1 C104.2 C105.2 C106.2 C107.1 C108.2 C114.1 C115.1 C116.1 C117.1 C118.1 C119.2 C120.2 C121.2 C122.2 C124.2 CN1.1 CN1.4 CN1.7 CN1.8 D2.1 D3.1 D4.1 D5.1 D6.1 D7.1 D8.1 D9.2 D10.1 D11.2 D12.1 D13.2 D14.2 D15.2 D16.2 D17.2 D18.2 D19.3(GND) D19.8(GND) D21.3(GND) D21.8(GND) FAN1.2 FAN1.3 FAN1.4 FEL.3 FEL.4 H1.6 H1.9 H1.14 H1.20 H1.25 H1.30 H1.34 H1.39 HDMIOUT.2(D2_SHIELD) HDMIOUT.5(D1_SHIELD) HDMIOUT.8(D0_SHIELD) HDMIOUT.11(CK_SHIELD) HDMIOUT.17(GND) HDMIOUT.20(SHD) HDMIOUT.21(SHD) HDMIOUT.22(SHD) HDMIOUT.23(SHD) L6.1 LED1.2(A) R1.1 R6.2 R8.1 R9.1 R11.1 R26.2 R30.1 R32.1 R35.1 R36.2 R40.1 R43.2 R44.1 R46.2 R52.2 R53.1 R56.1 RESET.3 RESET.4 RF1.2(GND) RF1.3(GND) SIM1.6(VSS) SIM1.9 SIM1.10 SIM1.12 SIM1.13 SIM1.14 U1.9(GND) U1.21(EPAD) U2.A1(GND1) U2.A10(GND2) U2.A18(GND3) U2.A21(GND4) U2.B6(GND5) U2.B16(GND6) U2.D19(GND7) U2.F14(GND8) U2.F15(GND9) U2.G13(GND10) U2.G14(GND11) U2.G15(GND12) U2.H10(GND13) U2.H11(GND14) U2.H12(GND15) U2.H13(GND16) U2.H14(GND17) U2.H15(GND18) U2.H19(GND19) U2.J12(GND20) U2.J13(GND21) U2.J14(GND22) U2.J15(GND23) U2.K8(GND25) U2.K9(GND26) U2.K10(GND27) U2.K11(GND28) U2.K12(GND29) U2.K13(GND30) U2.K14(GND31) U2.K15(GND32) U2.L21(GND33) U2.M1(GND24) U2.M2(GND34) U2.M3(GND35) U2.N6(GND36) U2.N9(GND37) U2.N12(GND38) U2.N15(GND39) U2.N18(GND40) U2.P3(GND41) U2.R5(GND42) U2.R21(GND43) U2.T1(GND44) U2.T3(GND45) U2.T8(GND46) U2.T10(GND47) U2.T15(GND48) U2.T17(GND49) U2.U6(GND50) U2.U13(GND51) U2.V1(GND52) U2.V5(GND53) U2.V12(GND54) U2.V19(GND55) U2.V21(GND56) U3.A9(VSS) U3.B1(VSSQ) U3.B3(VSS) U3.B9(VSSQ) U3.D1(VSSQ) U3.D8(VSSQ) U3.E1(VSS) U3.E2(VSSQ) U3.E8(VSSQ) U3.F9(VSSQ) U3.G1(VSSQ) U3.G8(VSS) U3.G9(VSSQ) U3.J2(VSS) U3.J8(VSS) U3.M1(VSS) U3.M9(VSS) U3.P1(VSS) U3.P9(VSS) U3.T1(VSS) U3.T9(VSS) U4.A6(VSS) U4.C4(VSSQ) U4.E7(VSS) U4.G5(VSS) U4.H10(VSS) U4.J5(VSS) U4.K8(VSS) U4.N2(VSSQ) U4.N5(VSSQ) U4.P4(VSSQ) U4.P6(VSSQ) U5.4(RXIP) U5.5(RXIN) U5.14(GND_SPS) U5.26(LED2/GPIO5) U5.28(GPIO4) U5.33(EP) USB1.12(1) USB1.13(2) USB1.14(3) USB1.15(4) USB1.A1B12(GND) USB1.B1A12(GND) USB2.12(1) USB2.13(2) USB2.14(3) USB2.15(4) USB2.A1B12(GND) USB2.B1A12(GND) USB3.12(1) USB3.13(2) USB3.14(3) USB3.15(4) USB3.A1B12(GND) USB3.B1A12(GND) USB4.12(1) USB4.13(2) USB4.14(3) USB4.15(4) USB4.A1B12(GND) USB4.B1A12(GND) X2.2(GND) X2.4(GND) X4.2(GND) X4.4(GND)
VCC_DRAM: C11.1 C13.1 C17.2 C18.2 C19.2 C20.2 C30.2 C31.2 C32.2 C33.2 C34.2 C35.2 C36.2 C37.2 C38.2 C39.2 C40.2 C41.2 C42.2 C43.2 C44.2 C45.2 C46.2 C47.2 C48.2 C49.2 C50.2 C51.2 C52.2 C53.2 C54.2 C55.2 C56.2 C57.2 C61.2 C62.2 C63.2 C64.2 C65.2 L3.2 R10.2 U1.4(DCDC3) U2.L9(VCC_DRAM1) U2.L10(VCC_DRAM2) U2.L11(VCC_DRAM3) U2.L12(VCC_DRAM4) U2.L13(VCC_DRAM5) U3.A1(VDDQ) U3.A8(VDDQ) U3.B2(VDD) U3.C1(VDDQ) U3.C9(VDDQ) U3.D2(VDDQ) U3.D9(VDD) U3.E9(VDDQ) U3.F1(VDDQ) U3.G7(VDD) U3.H2(VDDQ) U3.H9(VDDQ) U3.K2(VDD) U3.K8(VDD) U3.N1(VDD) U3.N9(VDD) U3.R1(VDD) U3.R9(VDD)
VDD_CPU: C8.1 C9.1 C24.2 C25.2 L2.2 U1.1(DCDC2) U2.H8(VDD_CPU1) U2.H9(VDD_CPU2) U2.J8(VDD_CPU3) U2.J9(VDD_CPU4) U2.J10(VDD_CPU5) U2.J11(VDD_CPU6) U2.L8(VDD_CPUFB)
VDD_GPU: C4.1 C6.1 C21.2 C22.2 C23.2 L1.2 U1.16(DCDC1) U2.F8(VDD_GPUFB) U2.F9(VDD_GPU1) U2.F10(VDD_GPU2) U2.F11(VDD_SYS1) U2.F12(VDD_SYS2) U2.F13(VDD_SYS3) U2.G8(VDD_GPU3) U2.G9(VDD_GPU4) U2.G10(VDD_SYS4) U2.G11(VDD_SYS5) U2.G12(VDD_SYS6)
ANT: C115.2 L8.1 RF1.1(SIG)
AP_REG_ON: U2.C9(PG12/H_I2S2_LRCK/BIST_RESULT1/AC_ADCL/PG_EINT12)
BT_RSTN: U2.C10(PG13/H_I2S2_DOUT0/H_I2S2_DIN1/BIST_RESULT2/AC_ADCR/PG_EINT13)
CS: R54.1 U2.B4(PG7/UART1_RX/JTAG_CK/PG_EINT7) U5.25(PDn)
D0+: D11.1 U2.J20(USB0_DP) USB1.A6(DP1) USB1.B6(DP2)
D0-: D9.1 U2.J19(USB0_DM) USB1.A7(DN1) USB1.B7(DN2)
D1+: D14.1 U2.M20(USB1_DP) USB2.A6(DP1) USB2.B6(DP2)
D1-: D13.1 U2.M19(USB1_DM) USB2.A7(DN1) USB2.B7(DN2)
D2+: D18.1 U2.L20(USB3_DP) USB3.A6(DP1) USB3.B6(DP2)
D2-: D17.1 U2.L19(USB3_DM) USB3.A7(DN1) USB3.B7(DN2)
D3+: D16.1 U2.K20(USB2_DP) USB4.A6(DP1) USB4.B6(DP2)
D3-: D15.1 U2.K19(USB2_DM) USB4.A7(DN1) USB4.B7(DN2)
EPHY_RTX: R26.1 U2.B19(EPHY_RTX)
EPHY_RXN: CN1.6 U2.B21(EPHY_RXN)
EPHY_RXP: CN1.5 U2.B20(EPHY_RXP)
EPHY_TXN: CN1.3 U2.A20(EPHY_TXN)
EPHY_TXP: CN1.2 U2.A19(EPHY_TXP)
FEL: FEL.1 FEL.2 U2.B17(FEL)
H5V: D22.1(K) HDMIOUT.18(+5V) R41.1 R47.1
HCEC: R38.1 U2.G17(HCEC)
HDCEC: HDMIOUT.13(CEC) R37.2 R38.2
HDHPD: HDMIOUT.19(HOT_PLUG_DET) R39.2
HDMI_0N: D21.2(IN2) D21.9(NC) HDMIOUT.9(D0-) U2.E20(HTX0N)
HDMI_0P: D21.1(IN1) D21.10(NC) HDMIOUT.7(D0+) U2.E19(HTX0P)
HDMI_1N: D19.5(IN4) D19.6(NC) HDMIOUT.6(D1-) U2.D21(HTX1N)
HDMI_1P: D19.4(IN3) D19.7(NC) HDMIOUT.4(D1+) U2.D20(HTX1P)
HDMI_2N: D19.2(IN2) D19.9(NC) HDMIOUT.3(D2-) U2.C20(HTX2N)
HDMI_2P: D19.1(IN1) D19.10(NC) HDMIOUT.1(D2+) U2.C19(HTX2P)
HDMI_CN: D21.5(IN4) D21.6(NC) HDMIOUT.12(CK-) U2.F21(HTXCN)
HDMI_CP: D21.4(IN3) D21.7(NC) HDMIOUT.10(CK+) U2.F20(HTXCP)
HDSCL: HDMIOUT.15(I2C-CLK) R41.2 R42.2
HDSDA: HDMIOUT.16(I2C_DATA) R45.2 R47.2
HHPD: R39.1 U2.G18(HHPD)
HSCL: R42.1 U2.F19(HSCL)
HSDA: R45.1 U2.G21(HSDA)
HXIN: C94.1 U2.B11(DXIN) X2.1(OSC1)
HXOUT: C99.1 U2.C12(DXOUT) X2.3(OSC2)
IRQ: R4.1 U2.C1(PC2/NAND_CLE/SPI0_MOSI/PC_EINT2)
LL: C89.1 R27.2 U2.G19(LINEOUTL)
LPCLK: U2.C8(PG10/H_I2S2_MCLK/X32KFOUT/AC_MCLK/PG_EINT10)
LR: C91.1 R29.2 U2.G20(LINEOUTR)
PH0: H1.23 U2.D16(PH0/UART0_TX/CAN_TX/PWM3/TWI1_SCK/PH_EINT0)
PH1: H1.22 U2.D15(PH1/UART0_RX/CAN_RX/PWM4/TWI1_SDA/PH_EINT1)
PH2: H1.37 U2.B15(PH2/UART5_TX/SPDIF_CLK/PWM2/TWI2_SCK/PH_EINT2/EPHY-SPD-LED)
PH3: H1.40 U2.C15(PH3/UART5_RX/SPDIF_IN/PWM1/TWI2_SDA/PH_EINT3/EPHY-LINK-LED)
PH4: H1.35 U2.A14(PH4/SPDIF_OUT/TWI3_SCK/PH_EINT4)
PH5: H1.27 U2.B14(PH5/UART2_TX/H_I2S3_MCLK/SPI1_CS0/TWI3_SDA/PH_EINT5)
PH6: H1.38 U2.C14(PH6/UART2_RX/H_I2S3_BCLK/SPI1_CLK/TWI4_SCK/PH_EINT6)
PH7: H1.24 U2.B12(PH7/UART2_RTS/H_I2S3_LRCK/SPI1_MOSI/TWI4_SDA/PH_EINT7)
PH8: H1.21 U2.C13(PH8/UART2_CTS/H_I2S3_DOUT0/SPI1_MISO/H_I2S3_DIN1/PH_EINT8)
PH9: H1.28 U2.A12(PH9/H_I2S3_DIN0/SPI1_CS1/H_I2S3_DOUT1/PH_EINT9)
PH10: H1.26 U2.B13(PH10/IR_RX/TCON_TRIG1/PH_EINT10)
PI0: H1.18 U2.H6(PI0/RGMII_RXD3/RMII_NULL/DMIC_CLK/H_I2S0_MCLK/HDMI_SCL/PI_EINT0)
PI1: H1.32 U2.D4(PI1/RGMII_RXD2/RMII_NULL/DMIC_DATA0/H_I2S0_BCLK/HDMI_SDA/PI_EINT1)
PI2: H1.19 U2.G6(PI2/RGMII_RXD1/RMII_RXD1/DMIC_DATA1/H_I2S0_LRCK/HDMI_CEC/PI_EINT2)
PI3: H1.29 U2.E4(PI3/RGMII_RXD0/RMII_RXD0/DMIC_DATA2/H_I2S0_DOUT0/H_I2S0_DIN1/PI_EINT3)
PI4: H1.11 U2.G5(PI4/RGMII_RXCK/RMII_NULL/DMIC_DATA3/H_I2S0_DIN0/H_I2S0_DOUT1/PI_EINT4)
PI5: H1.10 U2.H4(PI5/RGMII_RXCTL/RMII_CRS_DV/UART2_TX/TS0_CLK/TWI0_SCK/PI_EINT5)
PI6: H1.12 U2.H5(PI6/RGMII_NULL/RMII_RXER/UART2_RX/TS0_ERR/TWI0_SDA/PI_EINT6)
PI7: H1.13 U2.G4(PI7/RGMII_TXD3/RMII_NULL/UART2_RTS/TS0_SYNC/TWI1_SCK/PI_EINT7)
PI8: H1.36 U2.E6(PI8/RGMII_TXD2/RMII_NULL/UART2_CTS/TS0_DVLD/TWI1_SDA/PI_EINT8)
PI9: H1.31 U2.D5(PI9/RGMII_TXD1/RMII_TXD1/UART3_TX/TS0_D0/TWI2_SCK/PI_EINT9)
PI10: H1.3 U2.L5(PI10/RGMII_TXD0/RMII_TXD0/UART3_RX/TS0_D1/TWI2_SDA/PI_EINT10)
PI11: H1.8 U2.K4(PI11/RGMII_TXCK/RMII_TXCK/UART3_RTS/TS0_D2/PWM1/PI_EINT11)
PI12: H1.7 U2.K5(PI12/RGMII_TXCTL/RMII_TXEN/UART3_CTS/TS0_D3/PWM2/PI_EINT12)
PI13: H1.33 U2.E5(PI13/RGMII_CLKIN/RMII_NULL/UART4_TX/TS0_D4/PWM3/PI_EINT13)
PI14: H1.16 U2.L6(PI14/MDC/UART4_RX/TS0_D5/PWM4/PI_EINT14)
PI15: H1.5 U2.L4(PI15/MDIO/UART4_RTS/TS0_D6/CLK_FANOUT0/PI_EINT15)
PI16: H1.15 U2.K6(PI16/EPHY_25M/UART4_CTS/TS0_D7/CLK_FANOUT1/PI_EINT16)
PMU_SCK: R3.2 U1.6(SCL) U2.C18(PL0/RSB_SCK/S_TWI0_SCK)
PMU_SDA: R2.2 U1.5(SDA) U2.B18(PL1/RSB_SDA/S_TWI0_SDA)
PS: C2.1 C7.1 C10.1 D1.2(A) D22.2(A) H1.2 H1.4 U1.2(VIN3) U1.17(VIN1) U1.20(VIN2) USB1.A4B9(VBUS) USB1.B4A9(VBUS) USB2.A4B9(VBUS) USB2.B4A9(VBUS) USB3.A4B9(VBUS) USB3.B4A9(VBUS) USB4.A4B9(VBUS) USB4.B4A9(VBUS)
RESET: C100.2 R5.1 R28.1 R49.1 U2.A16(RESET)
SA0: U2.P18(SACT) U3.N3(A0)
SA1: U2.R15(SBA1) U3.P7(A1)
SA2: U2.T18(SA2) U3.P3(A2)
SA3: U2.R19(SA10) U3.N2(A3)
SA4: U2.U16(SA12) U3.P8(A4)
SA5: U2.R20(SCS1) U3.P2(A5)
SA6: U2.N13(SA15) U3.R8(A6)
SA7: U2.T21(SA0) U3.R2(A7)
SA8: U2.V17(SCS0) U3.T8(A8)
SA9: U2.T20(SODT0) U3.R3(A9)
SA10: U2.U19(SA8) U3.L7(A10/AP)
SA11: U2.U17(SA1) U3.R7(A11)
SA12: U2.P16(SA13) U3.N7(A12/BC#)
SA13: U2.R18(SA4) U3.T3(A13)
SA14: U2.P15(SA5) U3.T7(A14)
SA15: U2.U18(SA16) U3.M7(A15)
SBA0: U2.P20(SBG0) U3.M2(BA0)
SBA1: U2.U15(SA11) U3.N8(BA1)
SBA2: U2.U20(SA6) U3.M3(BA2)
SCAS: U2.N16(SA9) U3.K3(CAS#)
SCKE0: U2.V15(SCKE0) U3.K9(CKE0)
SCKE1: U2.P13(SCKE1) U3.J9(CKE1)
SCKN: R7.2 U2.U14(SCKN) U3.K7(CK_N)
SCKP: R7.1 U2.T14(SCKP) U3.J7(CK_P)
SCS0: U2.P21(SBG1) U3.L2(CS0#)
SCS1: U2.N19(SA7) U3.L1(CS1#)
SDC0_CLK: D5.2 R13.1 SIM1.5(CLK)
SDC0_CMD: D4.2 SIM1.3(CMD) U2.K3(PF3/SDC0_CMD/JTAG_DO/PF_EINT3)
SDC0_D0: D6.2 SIM1.7(DAT0) U2.J3(PF1/SDC0_D0/JTAG_DI/PF_EINT1)
SDC0_D1: D7.2 SIM1.8(DAT1) U2.J2(PF0/SDC0_D1/JTAG_MS/PF_EINT0)
SDC0_D2: D2.2 SIM1.1(DAT2) U2.L3(PF5/SDC0_D2/JTAG_CK/PF_EINT5)
SDC0_D3: D3.2 SIM1.2(CD/DAT3) U2.L2(PF4/SDC0_D3/UART0_RX/PF_EINT4)
SDC0_DET: R15.1 U2.K2(PF6/PF_EINT6)
SDC1_CLK: R14.1 U5.21(SPI_CLK/SD_CLK)
SDC1_CMD: U2.C7(PG1/SDC1_CMD/PG_EINT1) U5.22(SPI_MOSI/SD_CMD)
SDC1_D0: U2.C6(PG2/SDC1_D0/PG_EINT2) U5.19(SPI_MISO/SD_D0)
SDC1_D1: U2.B5(PG3/SDC1_D1/PG_EINT3) U5.20(SPI_SCSn/SD_D1)
SDC1_D2: U2.C5(PG4/SDC1_D2/PG_EINT4) U5.23(SPI_SIRQ/SD_D2)
SDC1_D3: U2.B7(PG5/SDC1_D3/PG_EINT5) U5.24(SD_D3)
SDC2_CLK: R12.1 U4.M6(CLK)
SDC2_CMD: R50.2 U2.E2(PC6/NAND_RB0/SDC2_CMD/BOOT_SEL4/PC_EINT6) U4.M5(CMD)
SDC2_D0: U2.F2(PC10/NAND_DQ5/SDC2_D0/PC_EINT10) U4.A3(DAT0)
SDC2_D1: U2.G3(PC13/NAND_DQ3/SDC2_D1/PC_EINT13) U4.A4(DAT1)
SDC2_D2: U2.H2(PC15/NAND_DQ1/SDC2_D2/SPI0_WP/PC_EINT15) U4.A5(DAT2)
SDC2_D3: U2.E3(PC8/NAND_DQ7/SDC2_D3/PC_EINT8) U4.B2(DAT3)
SDC2_D4: U2.F1(PC9/NAND_DQ6/SDC2_D4/PC_EINT9) U4.B3(DAT4)
SDC2_D5: U2.F3(PC11/NAND_DQ4/SDC2_D5/PC_EINT11) U4.B4(DAT5)
SDC2_D6: U2.H1(PC14/NAND_DQ2/SDC2_D6/PC_EINT14) U4.B5(DAT6)
SDC2_D7: U2.H3(PC16/NAND_DQ0/SDC2_D7/SPI0_HOLD/PC_EINT16) U4.B6(DAT7)
SDC2_DS: R51.2 U2.B1(PC0/NAND_WE/SDC2_DS/SPI0_CLK/PC_EINT0) U4.H5(DS)
SDC2_RST: U2.C2(PC1/NAND_ALE/SDC2_RST/PC_EINT1) U4.K5(RST_n)
SDQ0: U2.N3(SDQ0) U3.A2(DQU5)
SDQ1: U2.U4(SDQ1) U3.C8(DQU2)
SDQ2: U2.N2(SDQ2) U3.C2(DQU3)
SDQ3: U2.T4(SDQ3) U3.D7(DQU0)
SDQ4: U2.U3(SDQ4) U3.B8(DQU6)
SDQ5: U2.P1(SDQ5) U3.C3(DQU1)
SDQ6: U2.T2(SDQ6) U3.A7(DQU4)
SDQ7: U2.P2(SDQ7) U3.A3(DQU7)
SDQ8: U2.P5(SDQ8) U3.G2(DQL6)
SDQ9: U2.V3(SDQ9) U3.F7(DQL1)
SDQ10: U2.P4(SDQ10) U3.F2(DQL2)
SDQ11: U2.R4(SDQ11) U3.E3(DQL0)
SDQ12: U2.R6(SDQ12) U3.H8(DQL5)
SDQ13: U2.N4(SDQ13) U3.H3(DQL4)
SDQ14: U2.P6(SDQ14) U3.F8(DQL3)
SDQ15: U2.N5(SDQ15) U3.H7(DQL7)
SDQM0: U2.U1(SDQM0) U3.D3(DMU)
SDQM1: U2.R3(SDQM1) U3.E7(DML)
SDQS0N: U2.R1(SDQS0N) U3.B7(DQSU#)
SDQS0P: U2.R2(SDQS0P) U3.C7(DQSU)
SDQS1N: U2.V2(SDQS1N) U3.G3(DQSL#)
SDQS1P: U2.U2(SDQS1P) U3.F3(DQSL)
SODT0: U2.N20(SODT1) U3.K1(ODT0)
SODT1: U2.N21(SBA0) U3.J1(ODT1)
SRAS: U2.T16(SA3) U3.J3(RAS#)
SRST: U2.U21(SRST) U3.T2(RESET#)
SVREF: C58.2 C59.2 C60.2 R10.1 R11.2 U3.H1(VREFDQ) U3.M8(VREFCA)
SWE: U2.V20(SA14) U3.L3(WE#)
TV_OUT: AUDIO1.4 AUDIO1.7 D12.2 R30.2 U2.J21(TV_OUT)
TXPA_ON: C109.2 L5.1 U5.2(TXPA_ON)
TXPA_OP: C123.2 L4.1 U5.1(TXPA_OP)
UART1_CTS: U2.B3(PG9/UART1_CTS/JTAG_DI/AC_ADCY/PG_EINT9)
UART1_RTS: U2.C4(PG8/UART1_RTS/PLL_LOCK_DBG/JTAG_DO/PG_EINT8)
UART1_TX: R57.2 U2.A4(PG6/UART1_TX/JTAG_MS/PG_EINT6) U5.27(GPIO7)
USB0_ID: D20.2(K) USB1.A5(CC1) USB1.B5(CC2)
USB_ID: R34.1 U2.A2(PG18/UART2_CTS/MCSI_SDA/TWI3_SDA/PG_EINT18)
VD12D: C66.1 C67.1 C71.2 C102.2 C105.1 C106.1 C118.2 C120.1 L9.1 U5.6(VD12R) U5.7(VD12S) U5.12(VD12A) U5.13(VD12D) U5.31(VD12D)
WL_REG_ON: U2.B10(PG11/H_I2S2_BCLK/BIST_RESULT0/AC_SYNC/PG_EINT11)
XI: C121.1 R53.2 U5.10(XI) X4.3(OSC2)
XO: C122.1 U5.9(XO) X4.1(OSC1)
$1N16368: L1.1 U1.18(LX1)
$1N16426: L2.1 U1.19(LX2)
$1N16541: L3.1 U1.3(LX3)
$1N24681: C5.2 R1.2 U1.7(RTCLDO)
$1N28880: R4.2 U1.11(IRQ)
$1N28962: R5.2 U1.13(PWROK)
$1N30789: C12.2 U1.8(GPO)
$1N44518: D1.1(K) FAN1.1
$1N53902: LED1.1(K) R48.1
$2N2062: R6.1 U2.L15(SZQ)
$2N2223: R9.2 U3.L9(ZQ1)
$2N2224: R8.2 U3.L8(ZQ0)
$3N2117: C82.2 C83.2 U4.C2(VDDI)
$3N2831: R12.2 U2.D3(PC5/NAND_RE/SDC2_CLK/BOOT_SEL3/PC_EINT5)
$3N3551: R15.2 R16.2 SIM1.11
$3N9917: R13.2 U2.K1(PF2/SDC0_CLK/UART0_TX/PF_EINT2)
$3N12389: R14.2 U2.A6(PG0/SDC1_CLK/PG_EINT0)
$3N73904: R52.1 U2.D2(PC4/NAND_CE0/SPI0_MISO/BOOT_SEL2/PC_EINT4)
$3N82100: C110.2 C112.1 C123.1 L6.2
$3N82101: C109.1 C110.1 C119.1 L7.2
$3N82102: C112.2 C113.2 L7.1 L8.2
$3N82137: R55.2 R56.2 U5.29(GPIO1/(SPS_LDO_SEL))
$3N82163: L9.2 U5.15(LX_SPS)
$3N92283: C113.1 C114.2
$4N2198: C92.2 U2.J18(VRA1)
$4N2208: C93.2 U2.J17(VRA2)
$4N2209: R31.2 U2.K18(REXT)
$4N2219: C95.2 U2.D18(AC_AVCC)
$4N2220: C96.2 U2.C17(AC_VRA1)
$4N2243: C97.1 U2.D13(DXLDO_OUT)
$4N8213: R40.2 USB3.A5(CC1)
$4N8354: R43.1 USB3.B5(CC2)
$4N8495: R44.2 USB4.A5(CC1)
$4N8636: R46.1 USB4.B5(CC2)
$4N8777: R35.2 USB2.A5(CC1)
$4N8918: R36.1 USB2.B5(CC2)
$4N12583: D20.1(A) R33.1 R34.2
$4N26086: D23.1(K) R37.1
$4N34203: AUDIO1.3 AUDIO1.6 C91.2 D10.2
$4N34315: AUDIO1.2 AUDIO1.5 C89.2 D8.2
$4N36516: C88.2 R27.1
$4N36638: C90.2 R29.1
$4N42572: C87.1 R28.2 RESET.1 RESET.2

Not connected (* = marked no-connect by the designer): HDMIOUT 14(HEC)*; U1 10(NC)* 14(PWRON)*; U2 A8(PG15/UART2_TX/TWI4_SCK/PG_EINT15)* B2(PG19/MCSI_MCLK/PWM1/PG_EINT19)* B8(PG16/UART2_RX/TWI4_SDA/PG_EINT16)* B9(PG14/H_I2S2_DIN0/H_I2S2_DOUT1/BIST_RESULT3/AC_ADCX/PG_EINT14)* C3(PG17/UART2_RTS/MCSI_SCK/TWI3_SCK/PG_EINT17)* C11(REFCLK_OUT)* C16(JTAG_SEL)* D1(PC3/NAND_CE1/SPI0_CS0/BOOT_SEL1/PC_EINT3)* D14(PLLTEST)* F4(PC7/NAND_RB1/SPI0_CS1/PC_EINT7)* G2(PC12/NAND_DQS/PC_EINT12)* L18(LRADC)* N7(SDQ26)* N10(SDQM3)* P7(SDQ25)* P9(SDQ27)* P10(SDQ28)* P12(SDQ30)* R9(SDQ24)* R12(SDQ31)* T5(SDQ23)* T6(SDQ20)* T7(SDQ22)* T9(SDQM2)* T11(SDQ16)* T12(SDQ18)* U5(SDQ21)* U8(SDQS2N)* U9(SDQ19)* U10(SDQS3N)* U11(SDQ29)* U12(SDQ17)* V8(SDQS2P)* V10(SDQS3P)*; U4 G3(RFU)*; U5 32(GPIO6/(TEST_MODE_SEL))*; USB1 A8(SBU1)* B8(SBU2)*; USB2 A8(SBU1)* B8(SBU2)*; USB3 A8(SBU1)* B8(SBU2)*; USB4 A8(SBU1)* B8(SBU2)*

## Notes on the sheets
sheet 3
- 1101 BOOT SEL: SDCARD -> EMMC
- R8
- 经过测试R55 R57不接悬空
  by aixiao.me
  date:20231104
- R9
- R11
- 6、7、8
- L11
- 13 PIN
sheet 4
- DEBUG BTNs
- The external network transformer
  must be connected
- USB Type A2C Only
  > For USB OTG
